# EasyEDA Pro project TeenyV4.eprj, schematic Schematic1

## Sheets
1 Teensy: Board Name: Board1; Create Date: 2025-07-09; Page Name: Teensy; Project Name: TeenyV4; Schematic Name: Schematic1; Update Date: 2025-07-09; Company: Wimble Robotics; Drawed: Michael Wimble; Page Size: A4; Part Number: JLCPCB-002; Reviewed: Michael Wimble; Version: V1.0
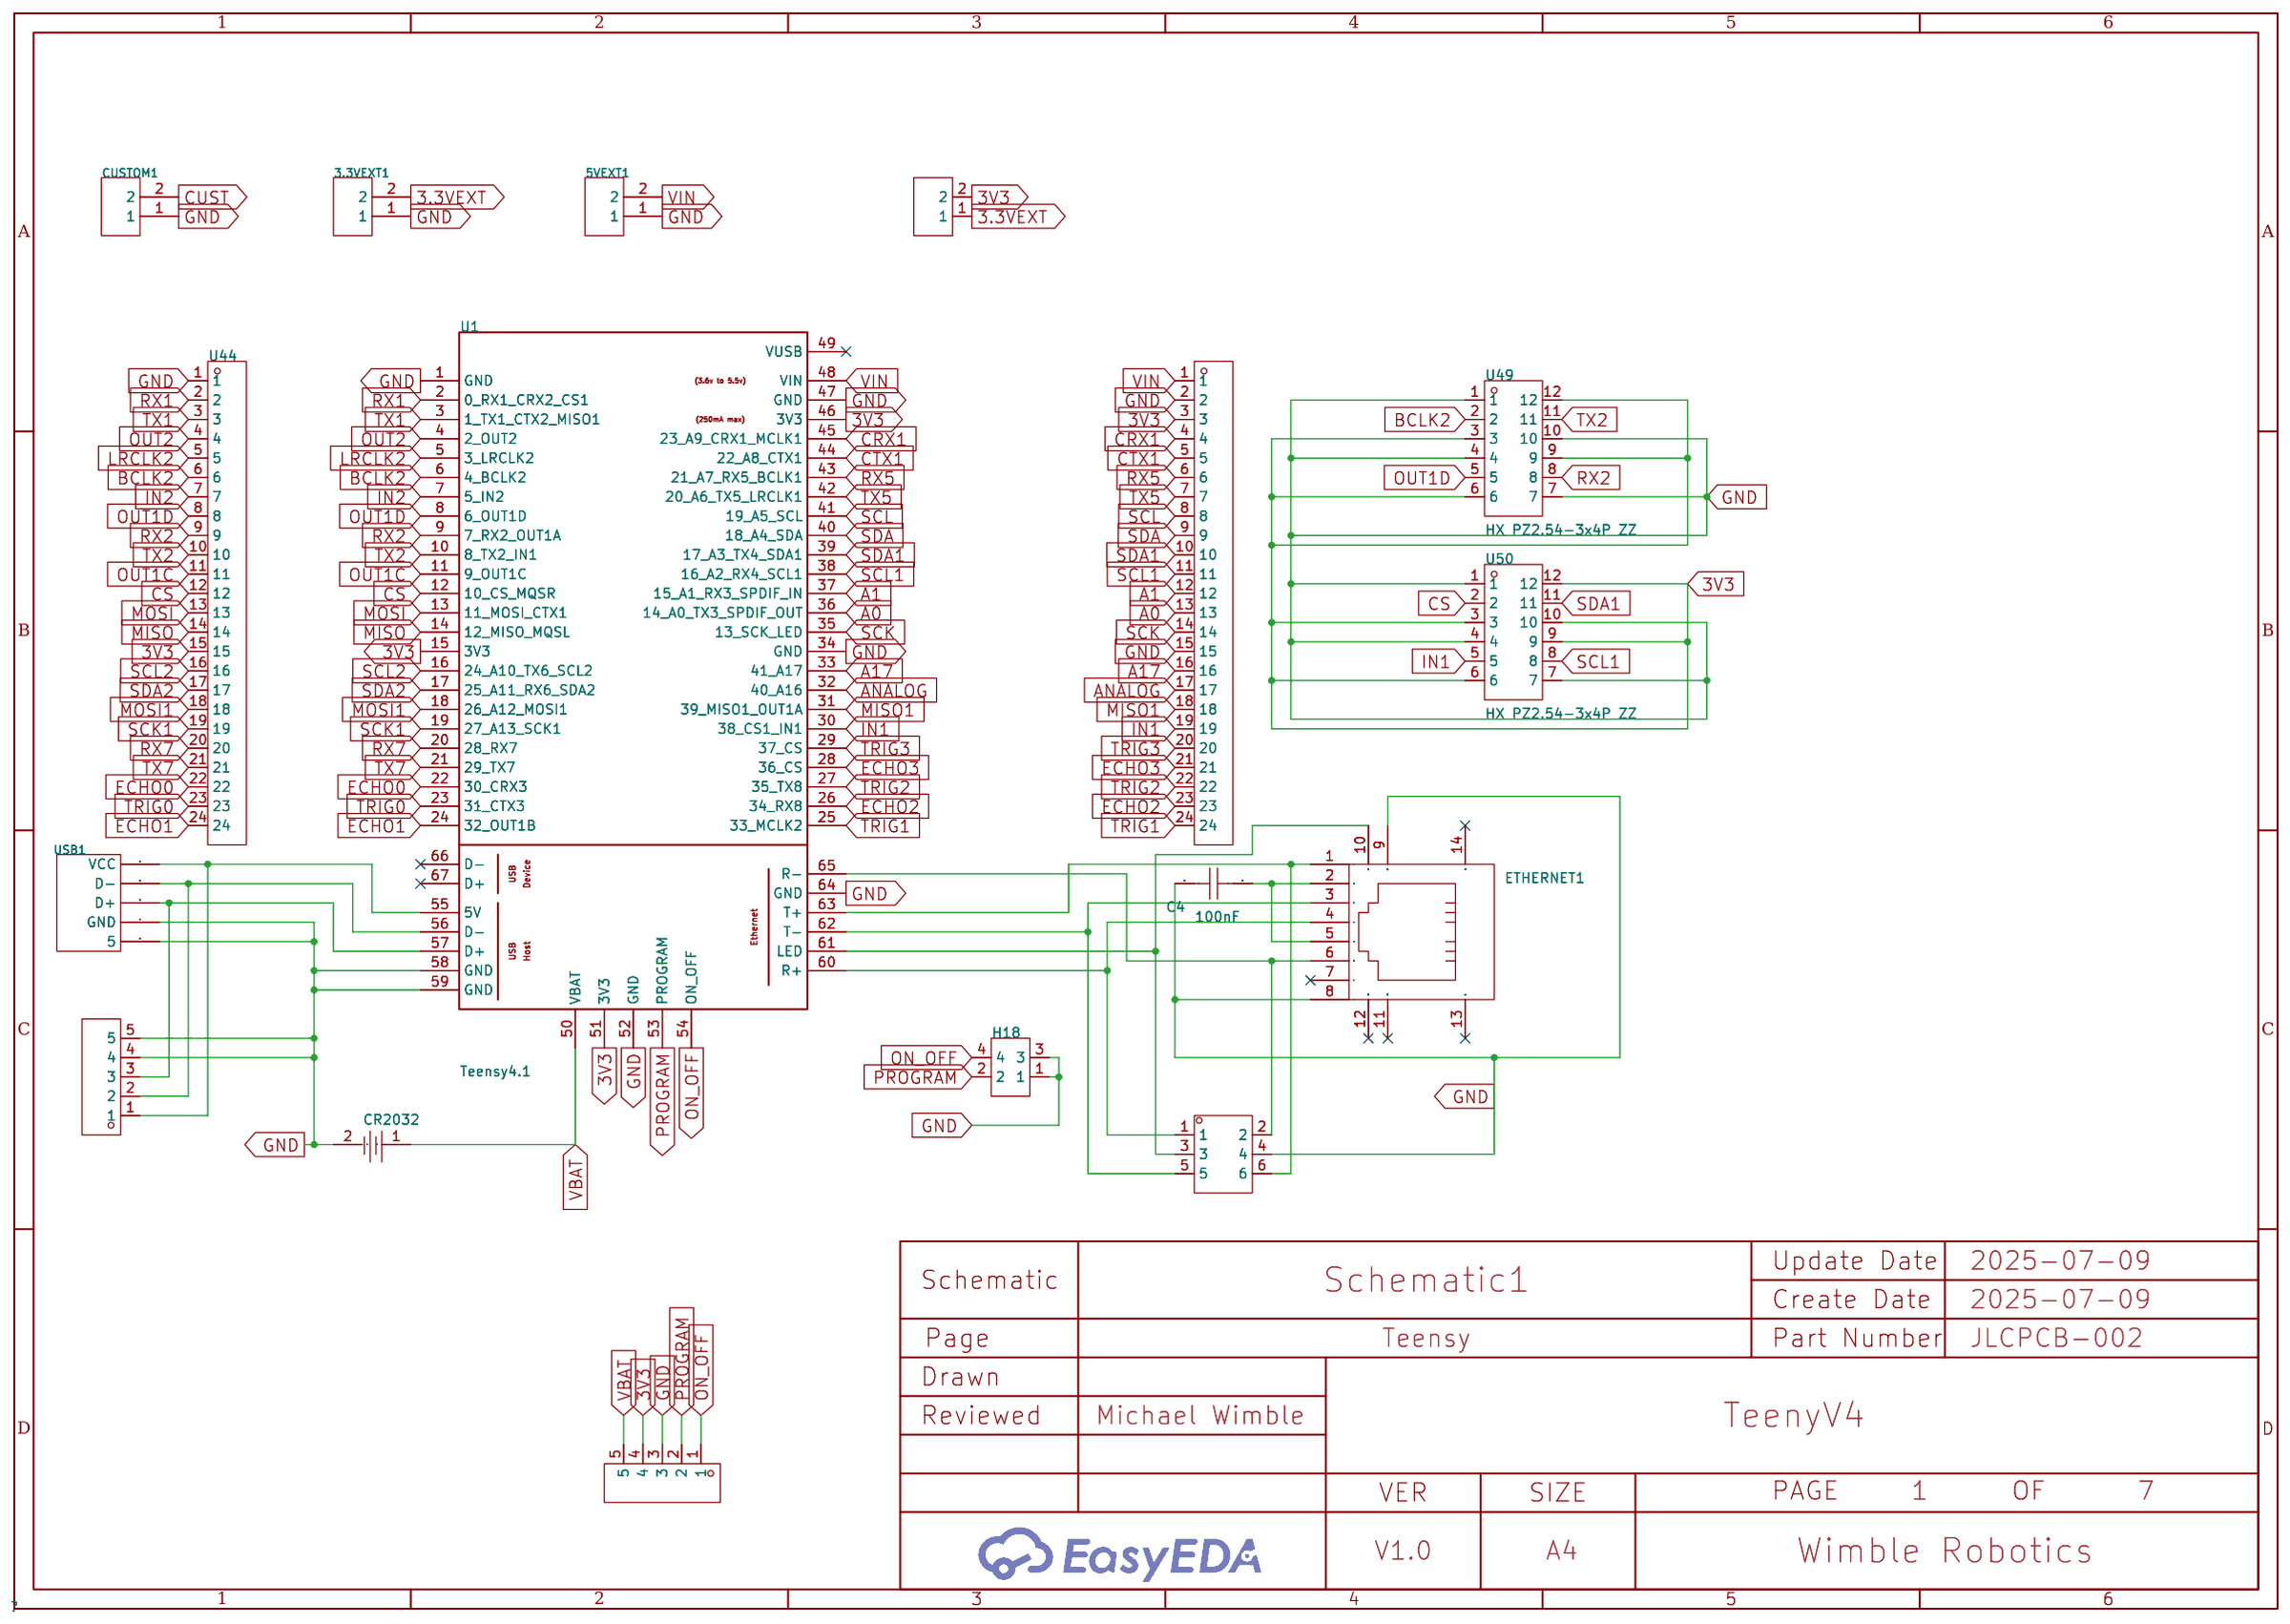
[diagram p0: Teensy]
2 PWM Block: Page Name: PWM Block
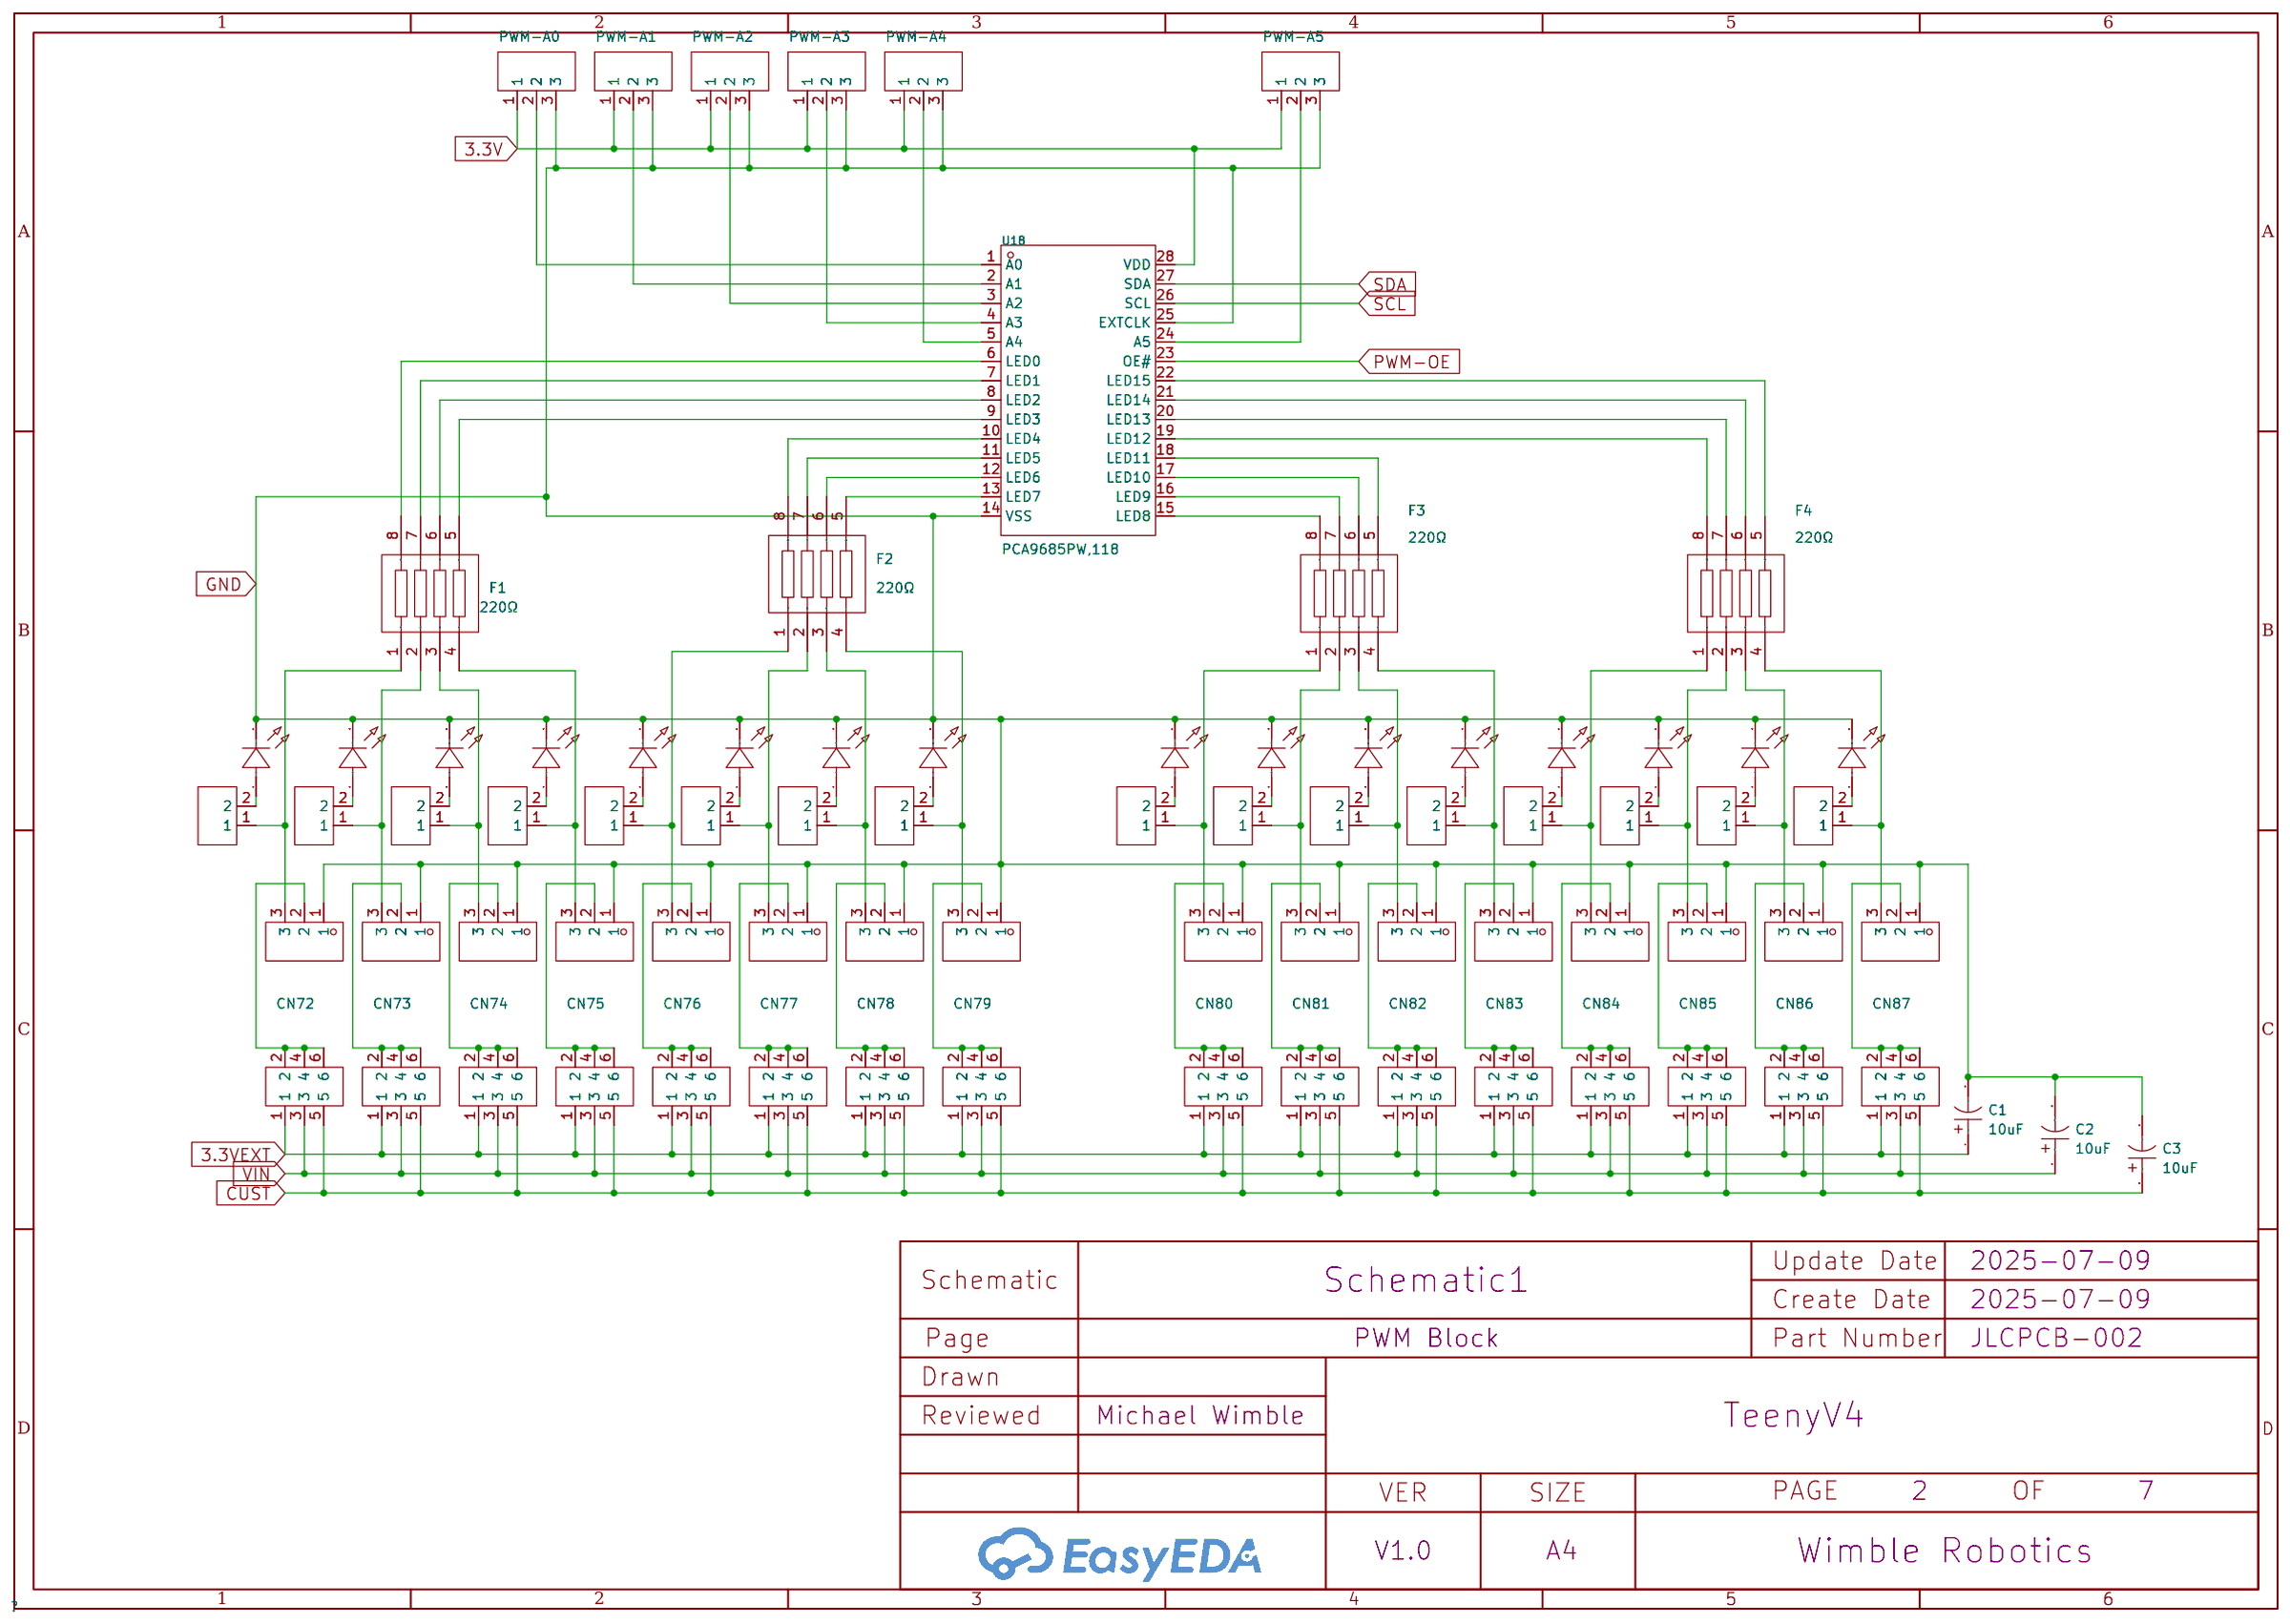
[diagram p1: PWM Block]
3 I2C: Create Date: 2025-07-10; Page Name: I2C
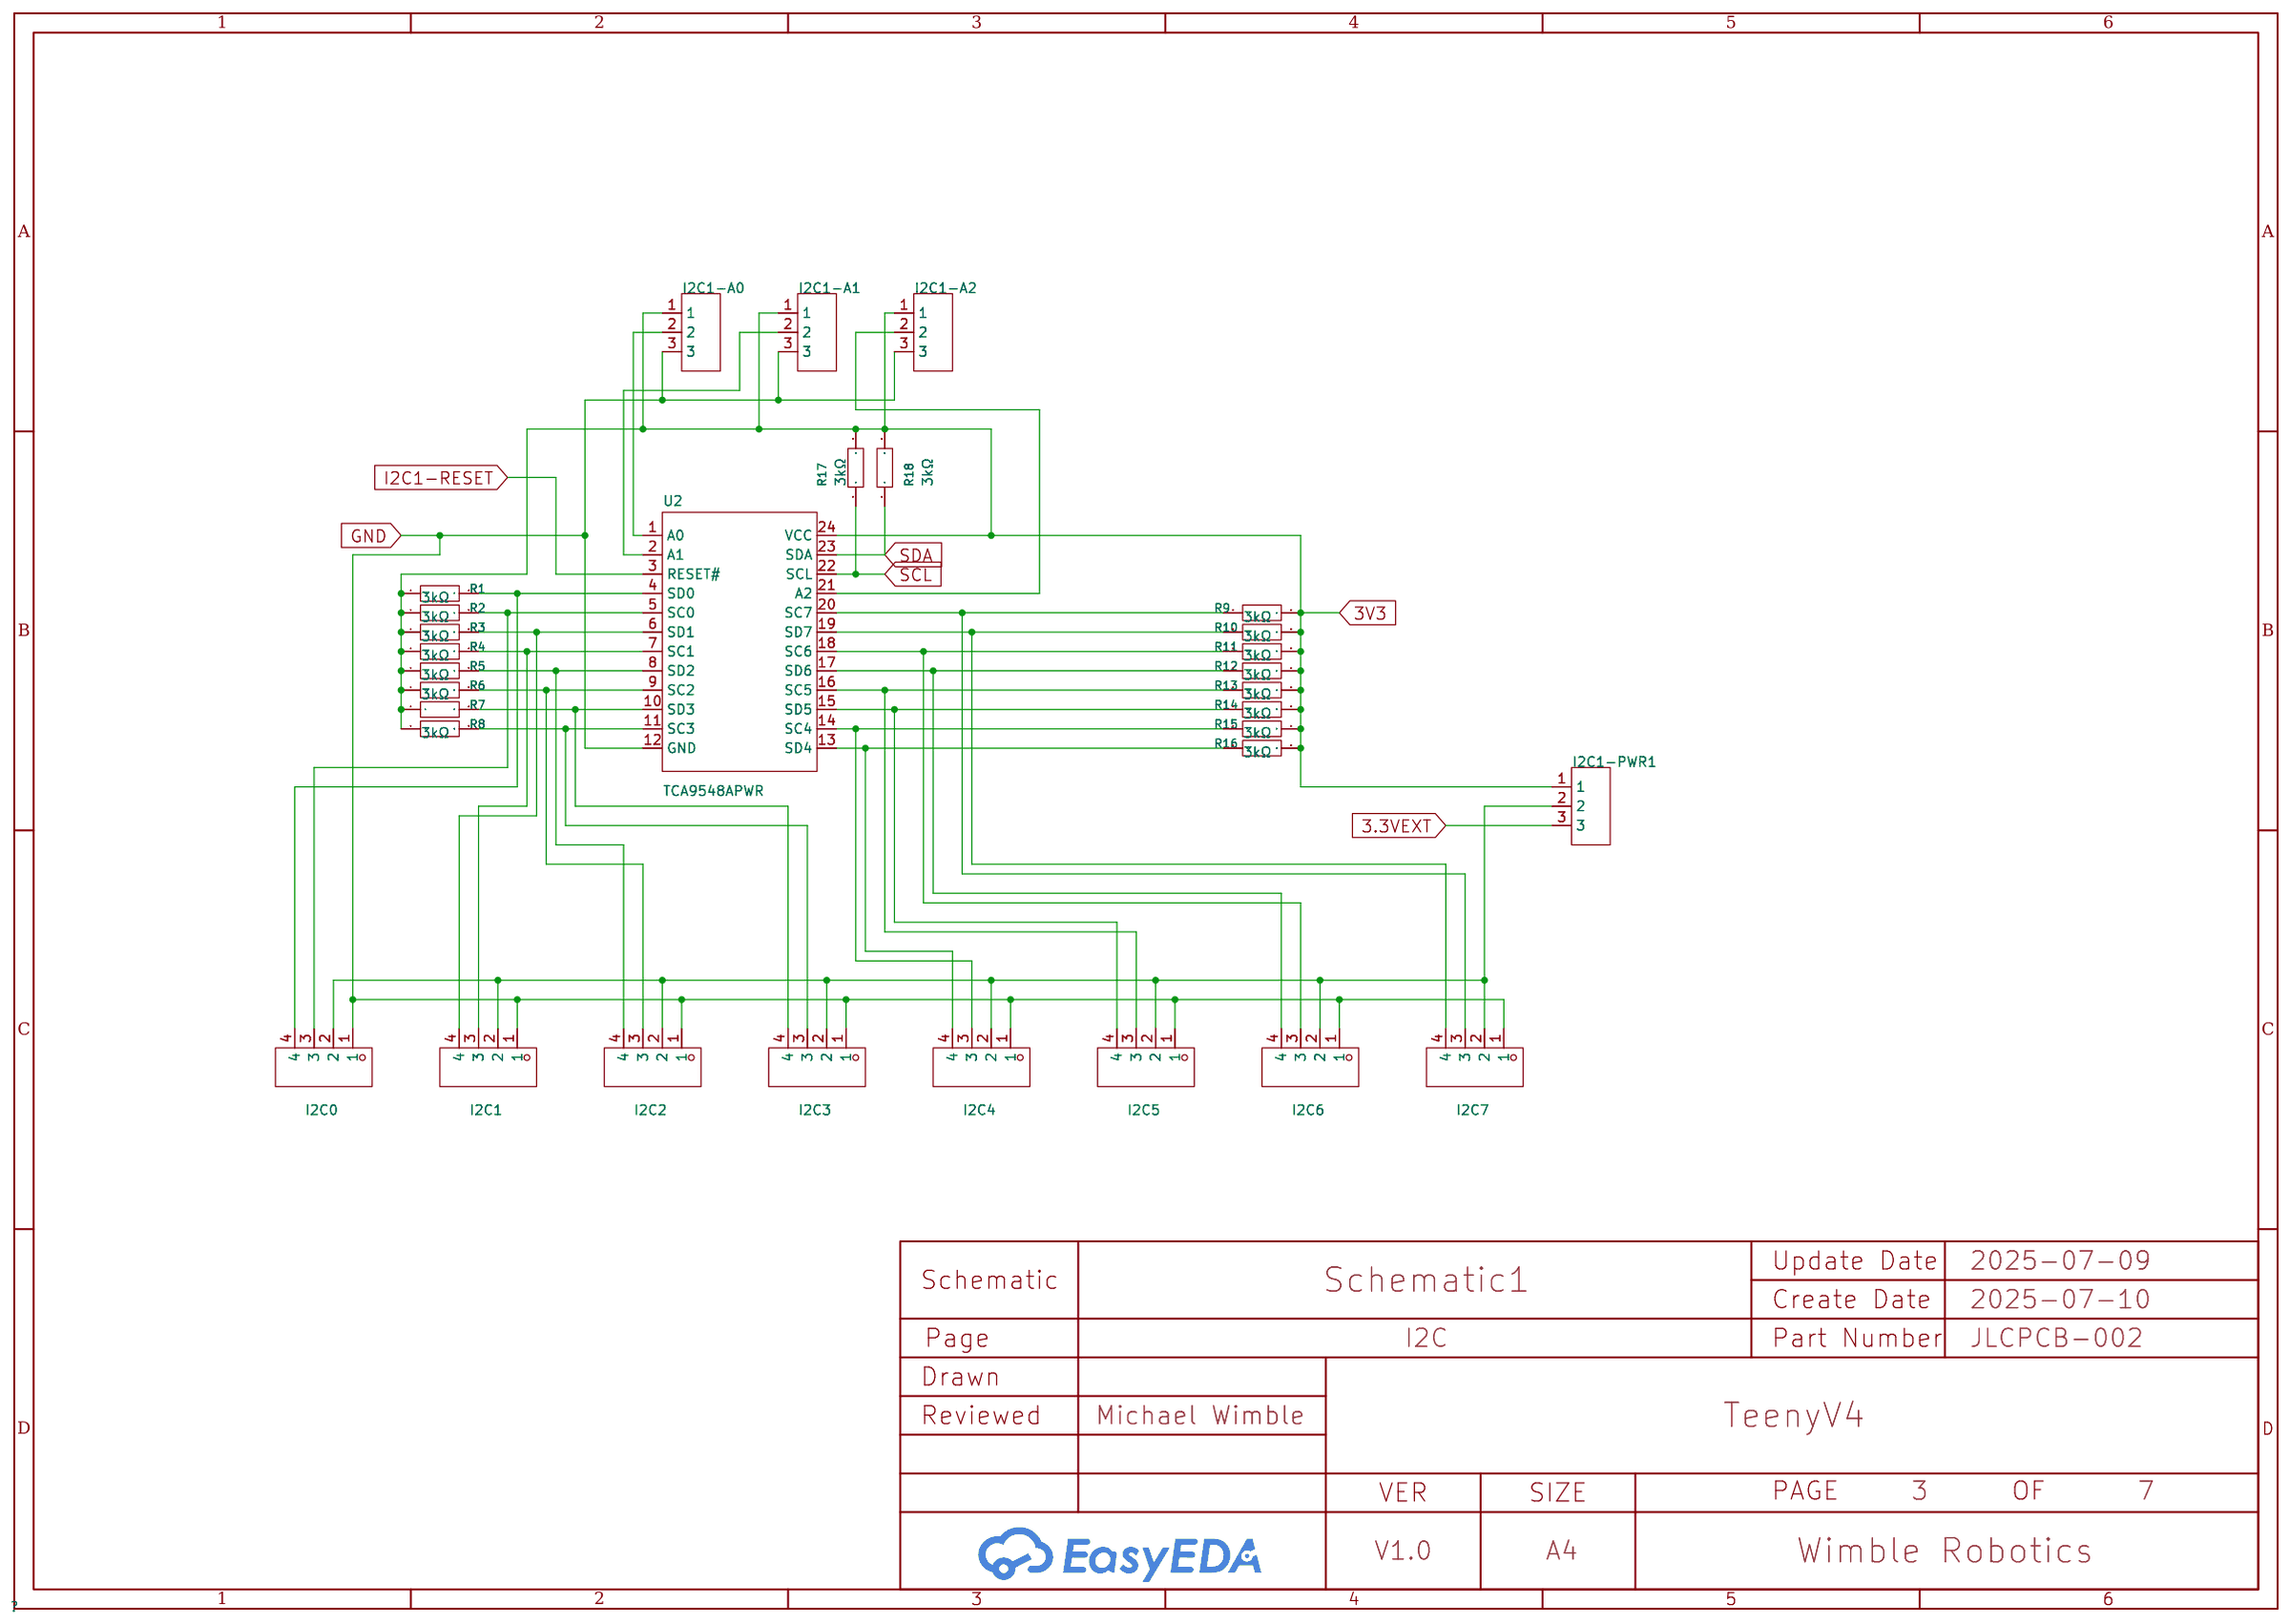
[diagram p2: I2C]
4 GPIO: Create Date: 2025-07-10; Page Name: P4
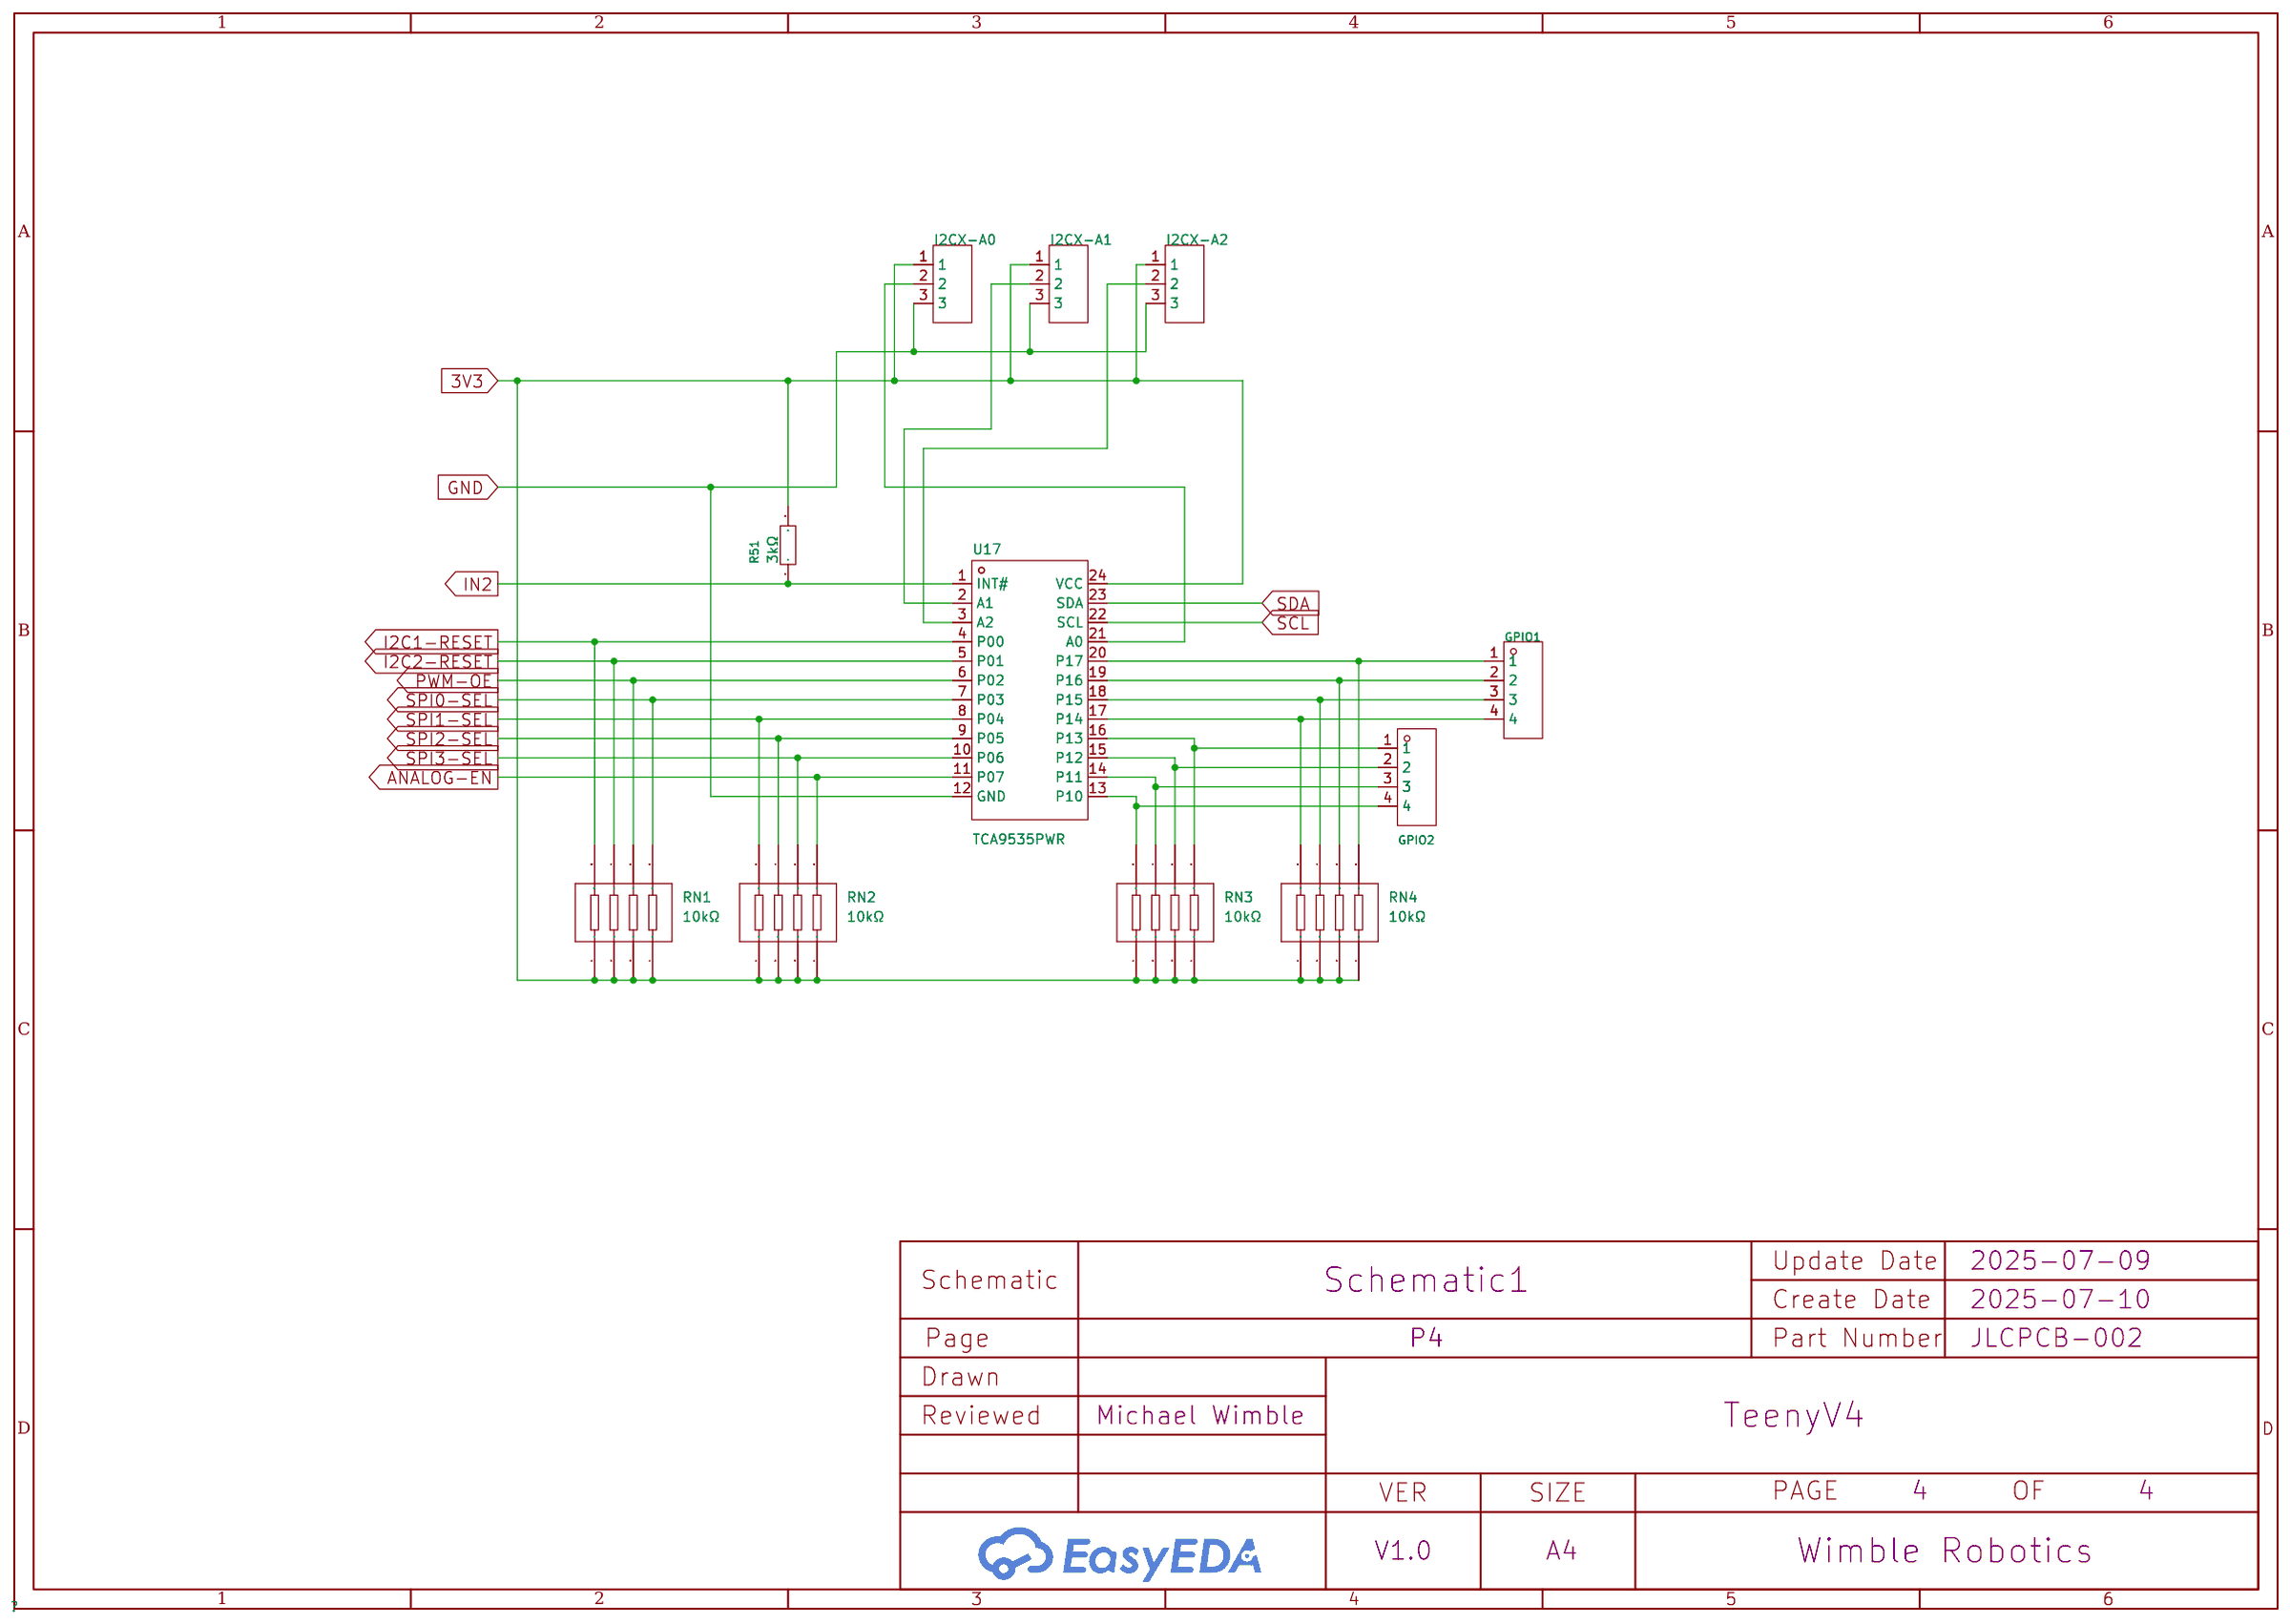
[diagram p3: GPIO]
5 Misc: Create Date: 2025-07-10; Page Name: Misc
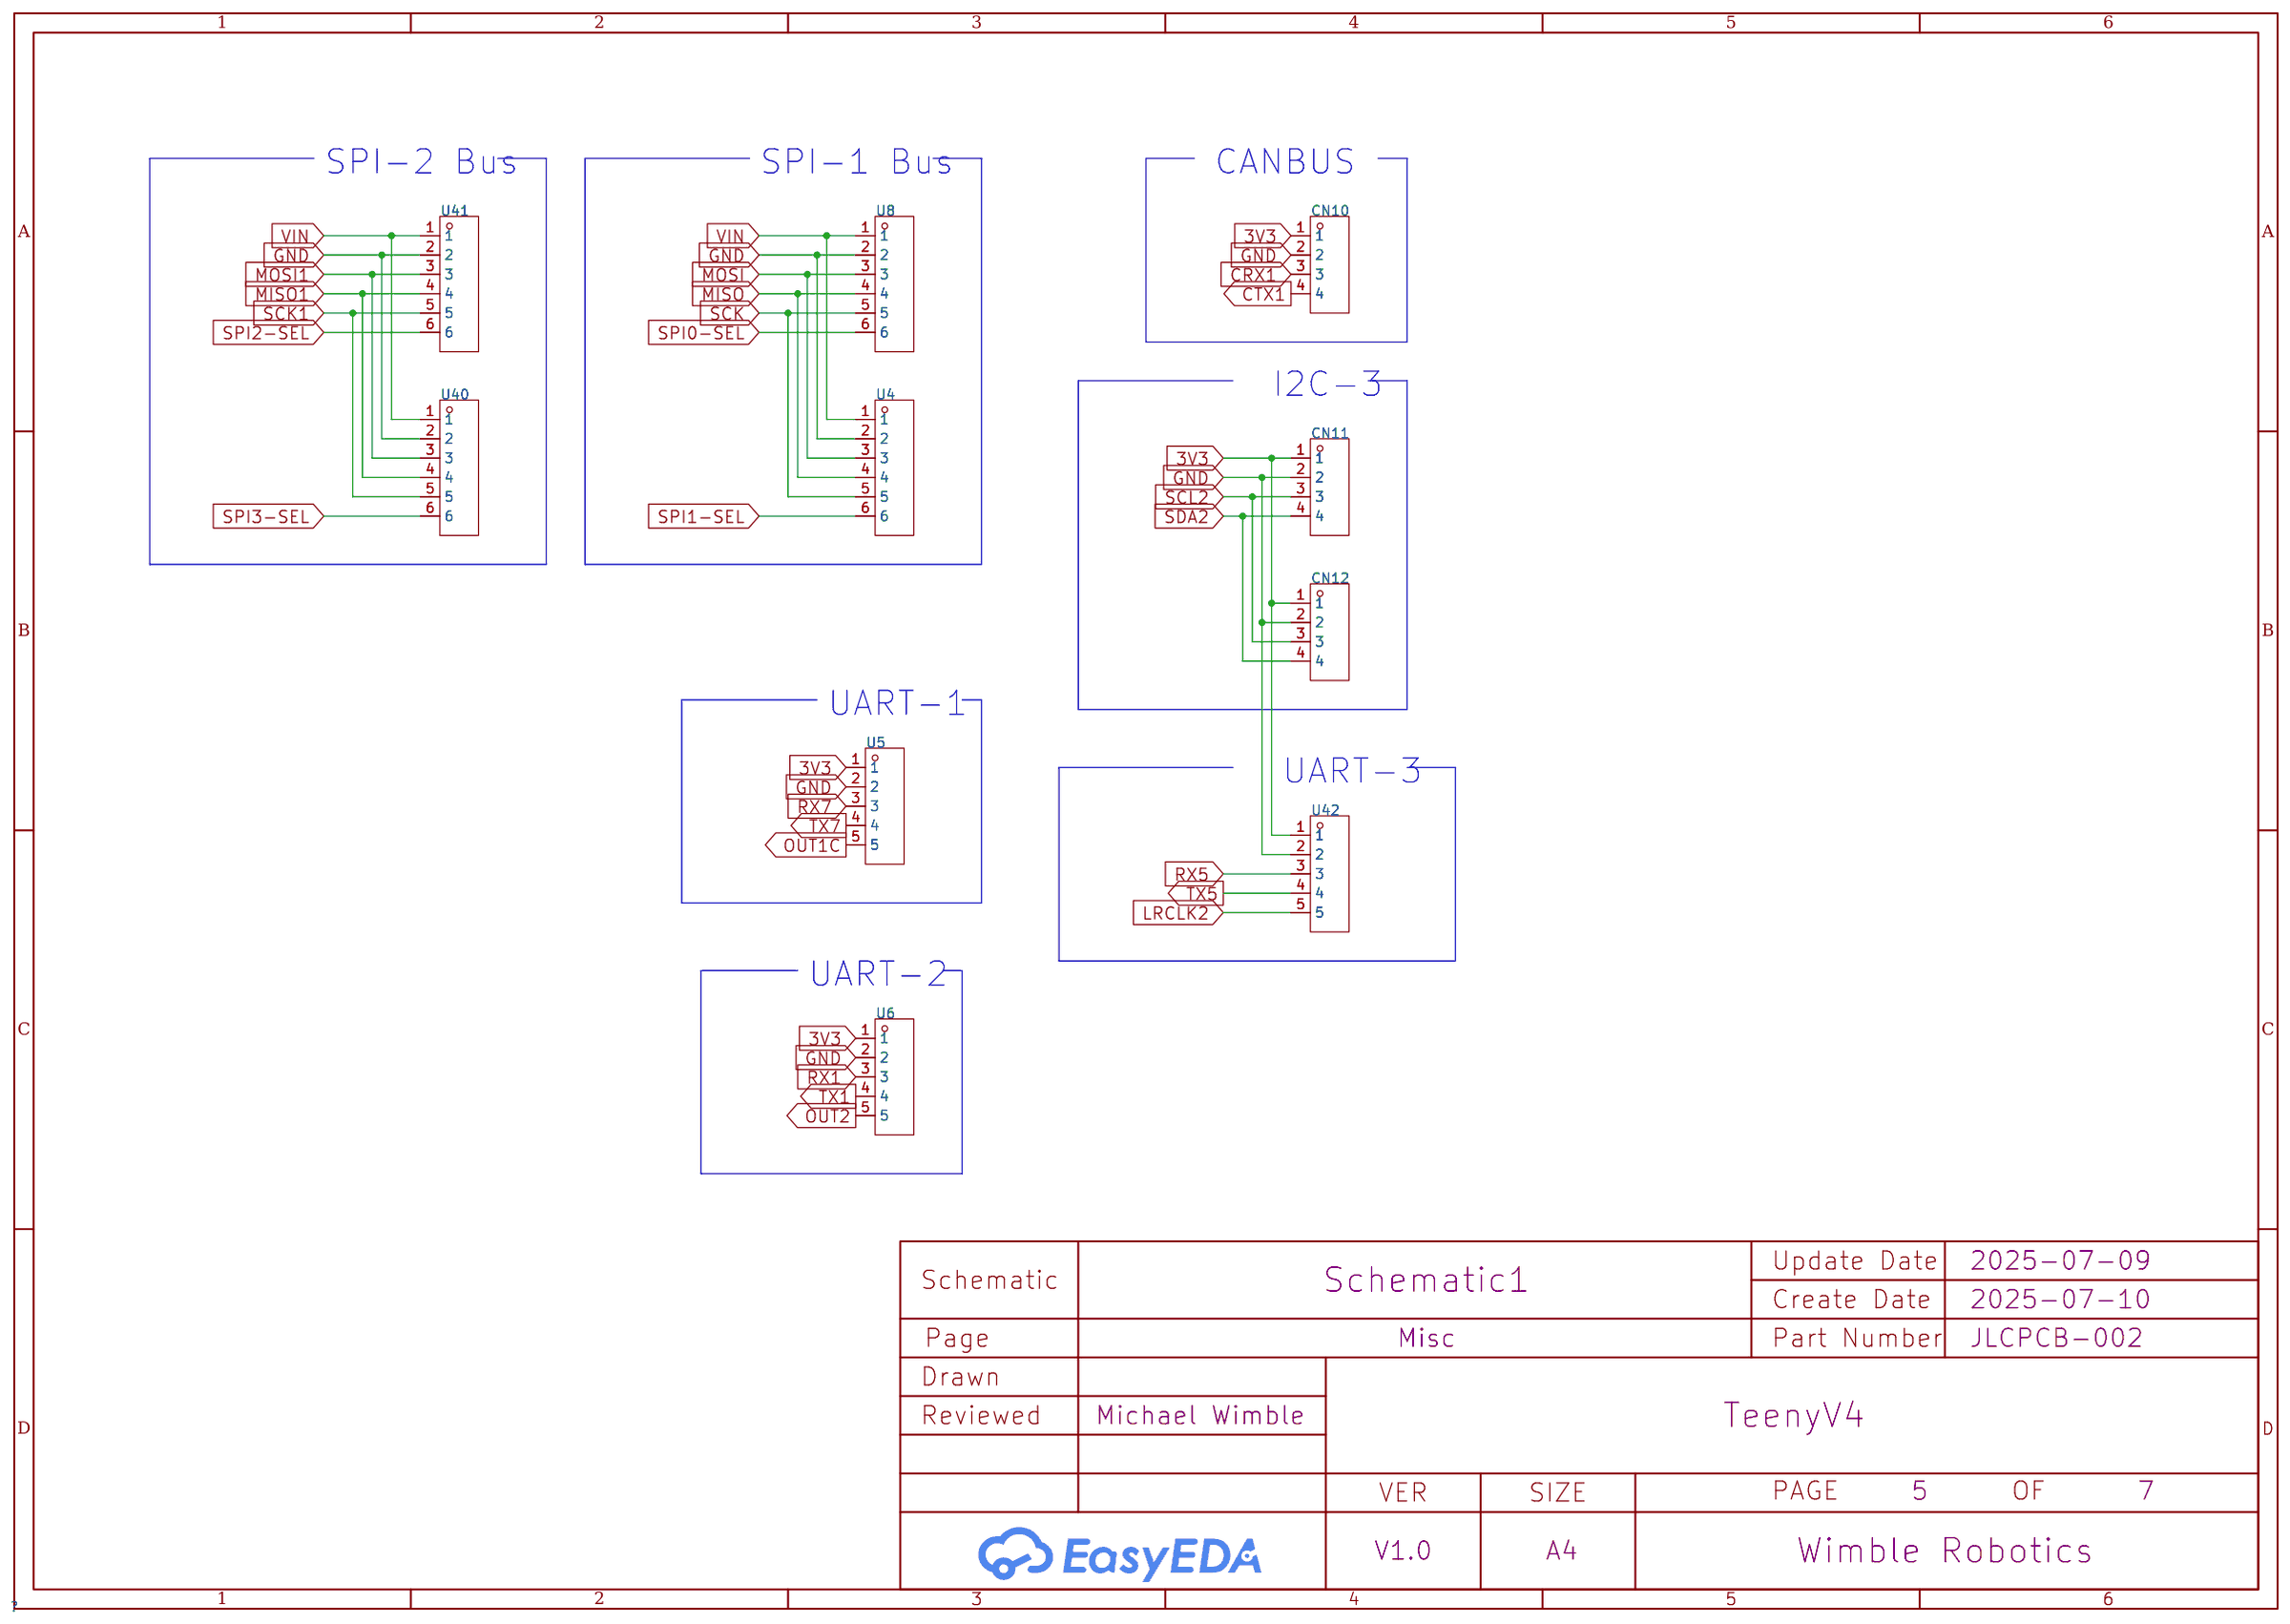
[diagram p4: Misc]
6 Analog: Create Date: 2025-07-10; Page Name: Analog
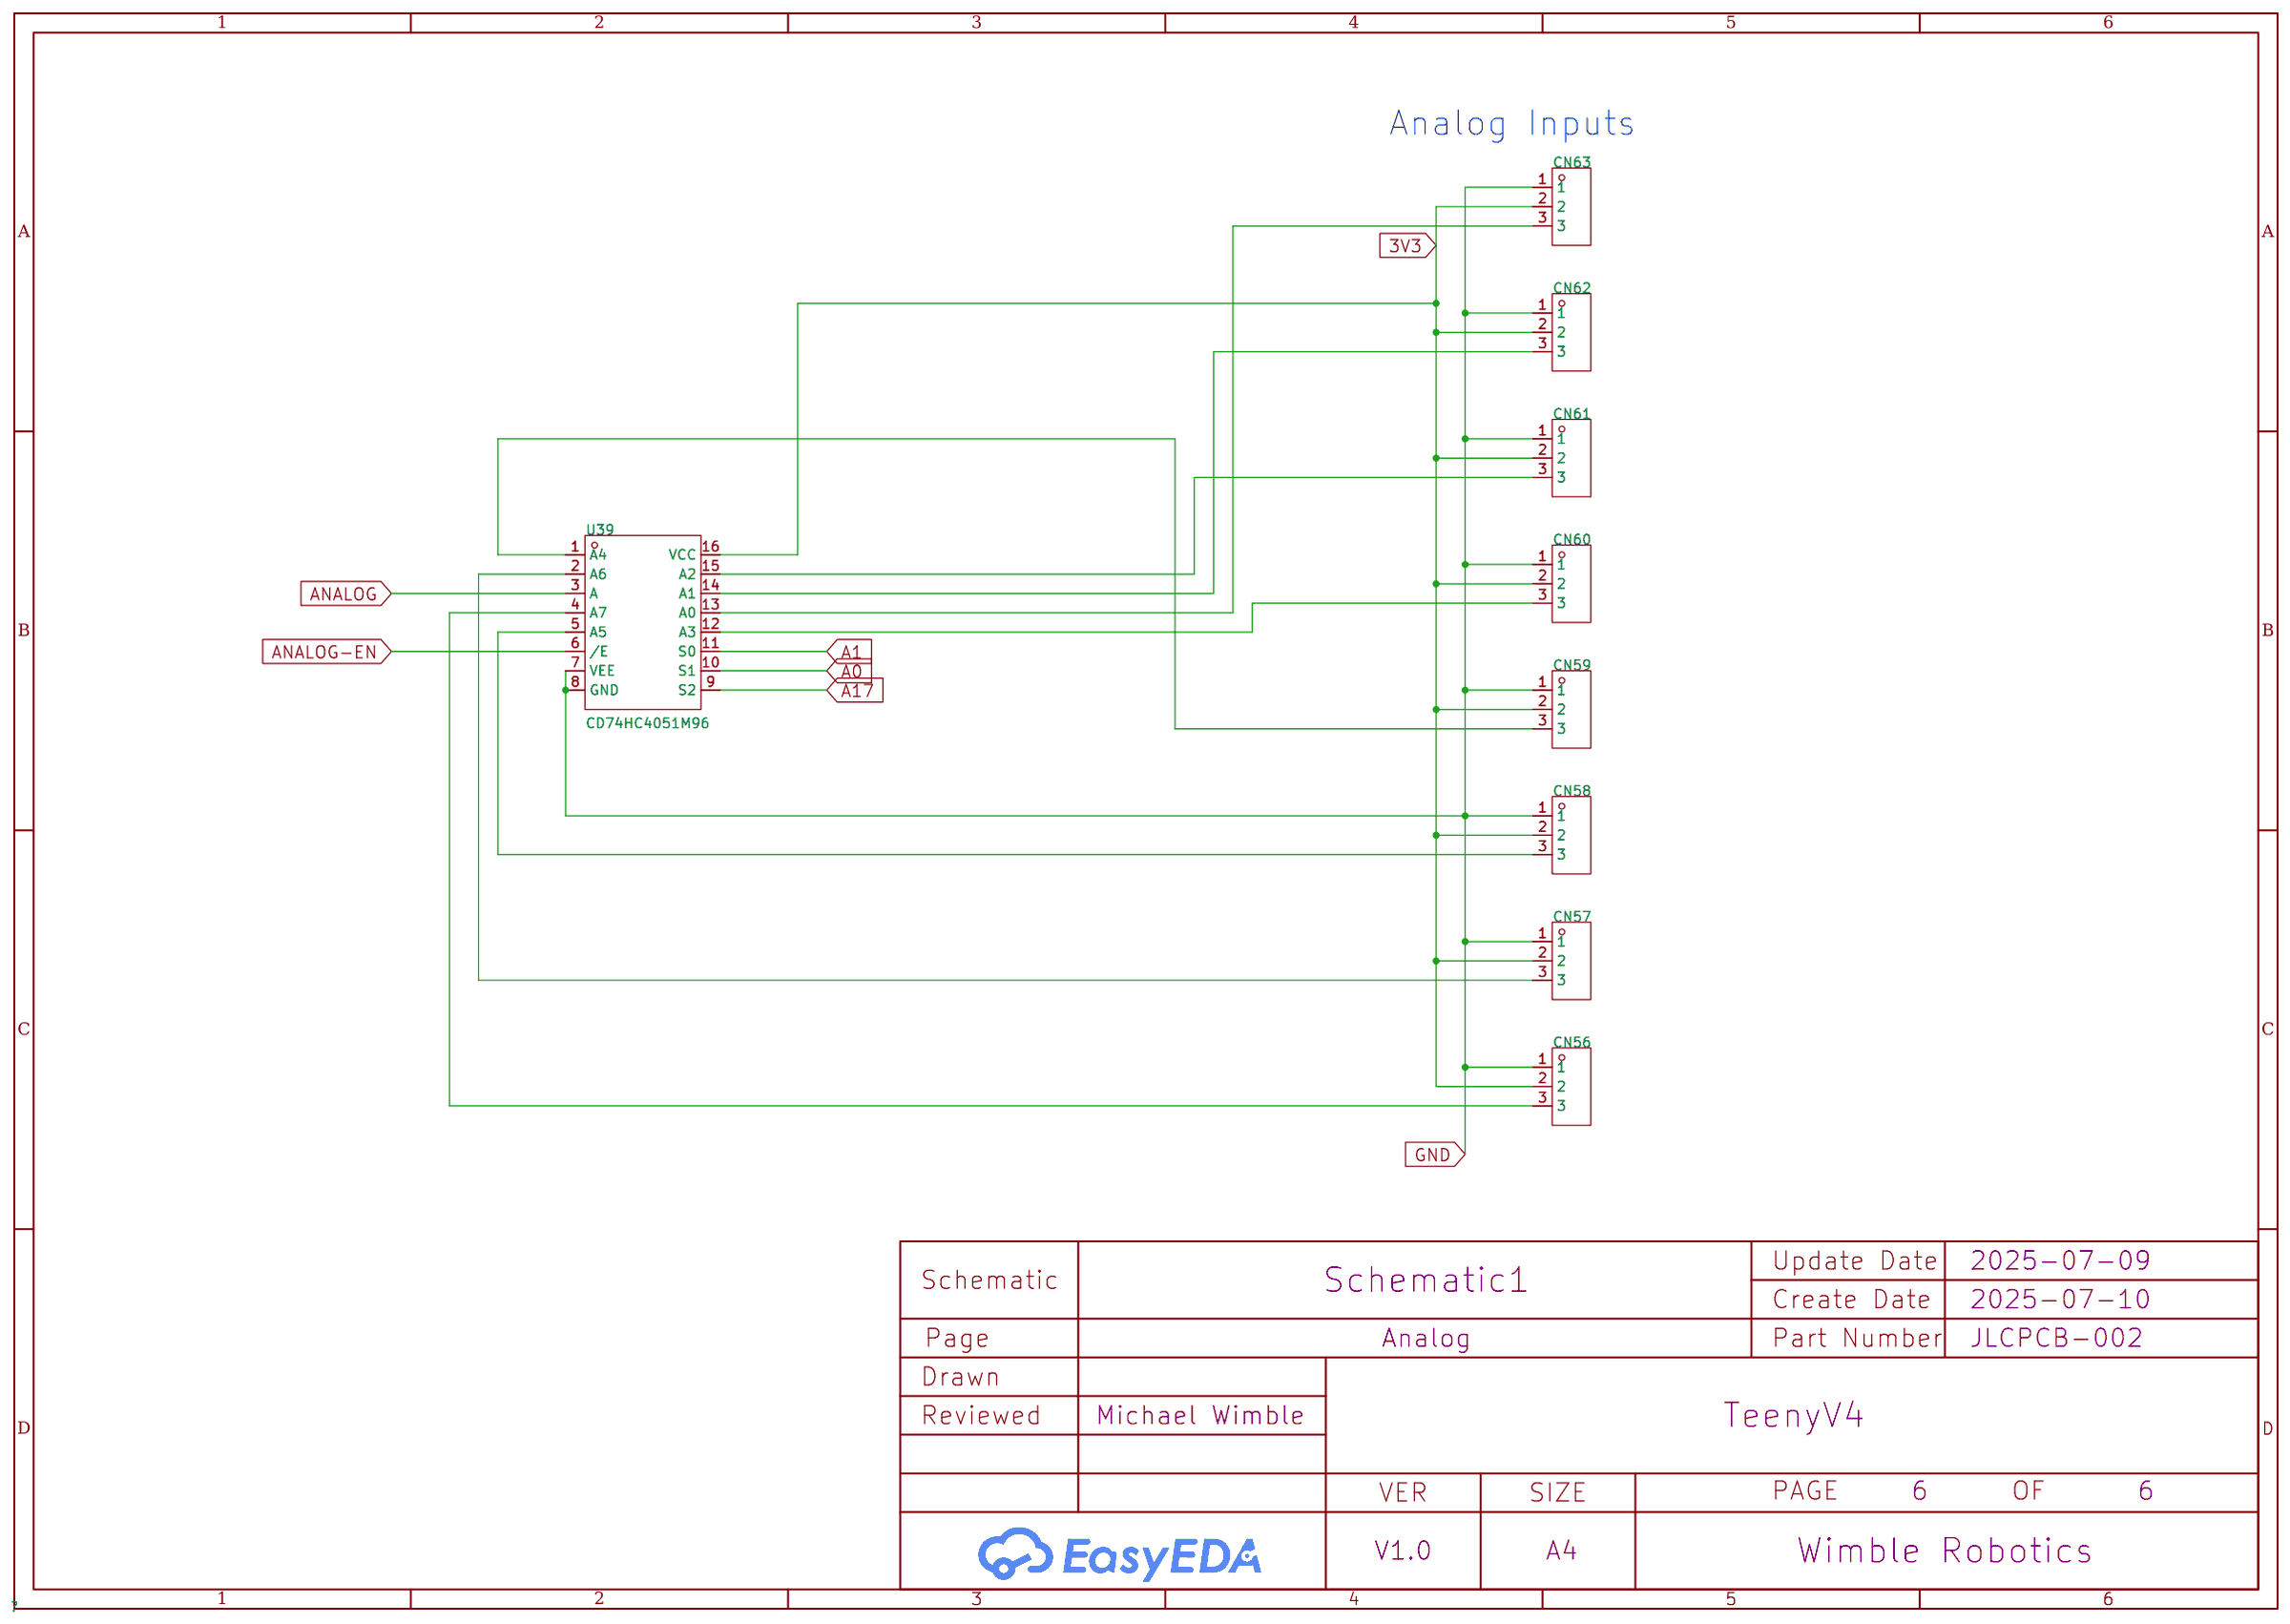
[diagram p5: Analog]
7 Sonar: Create Date: 2025-07-10; Page Name: Sonar
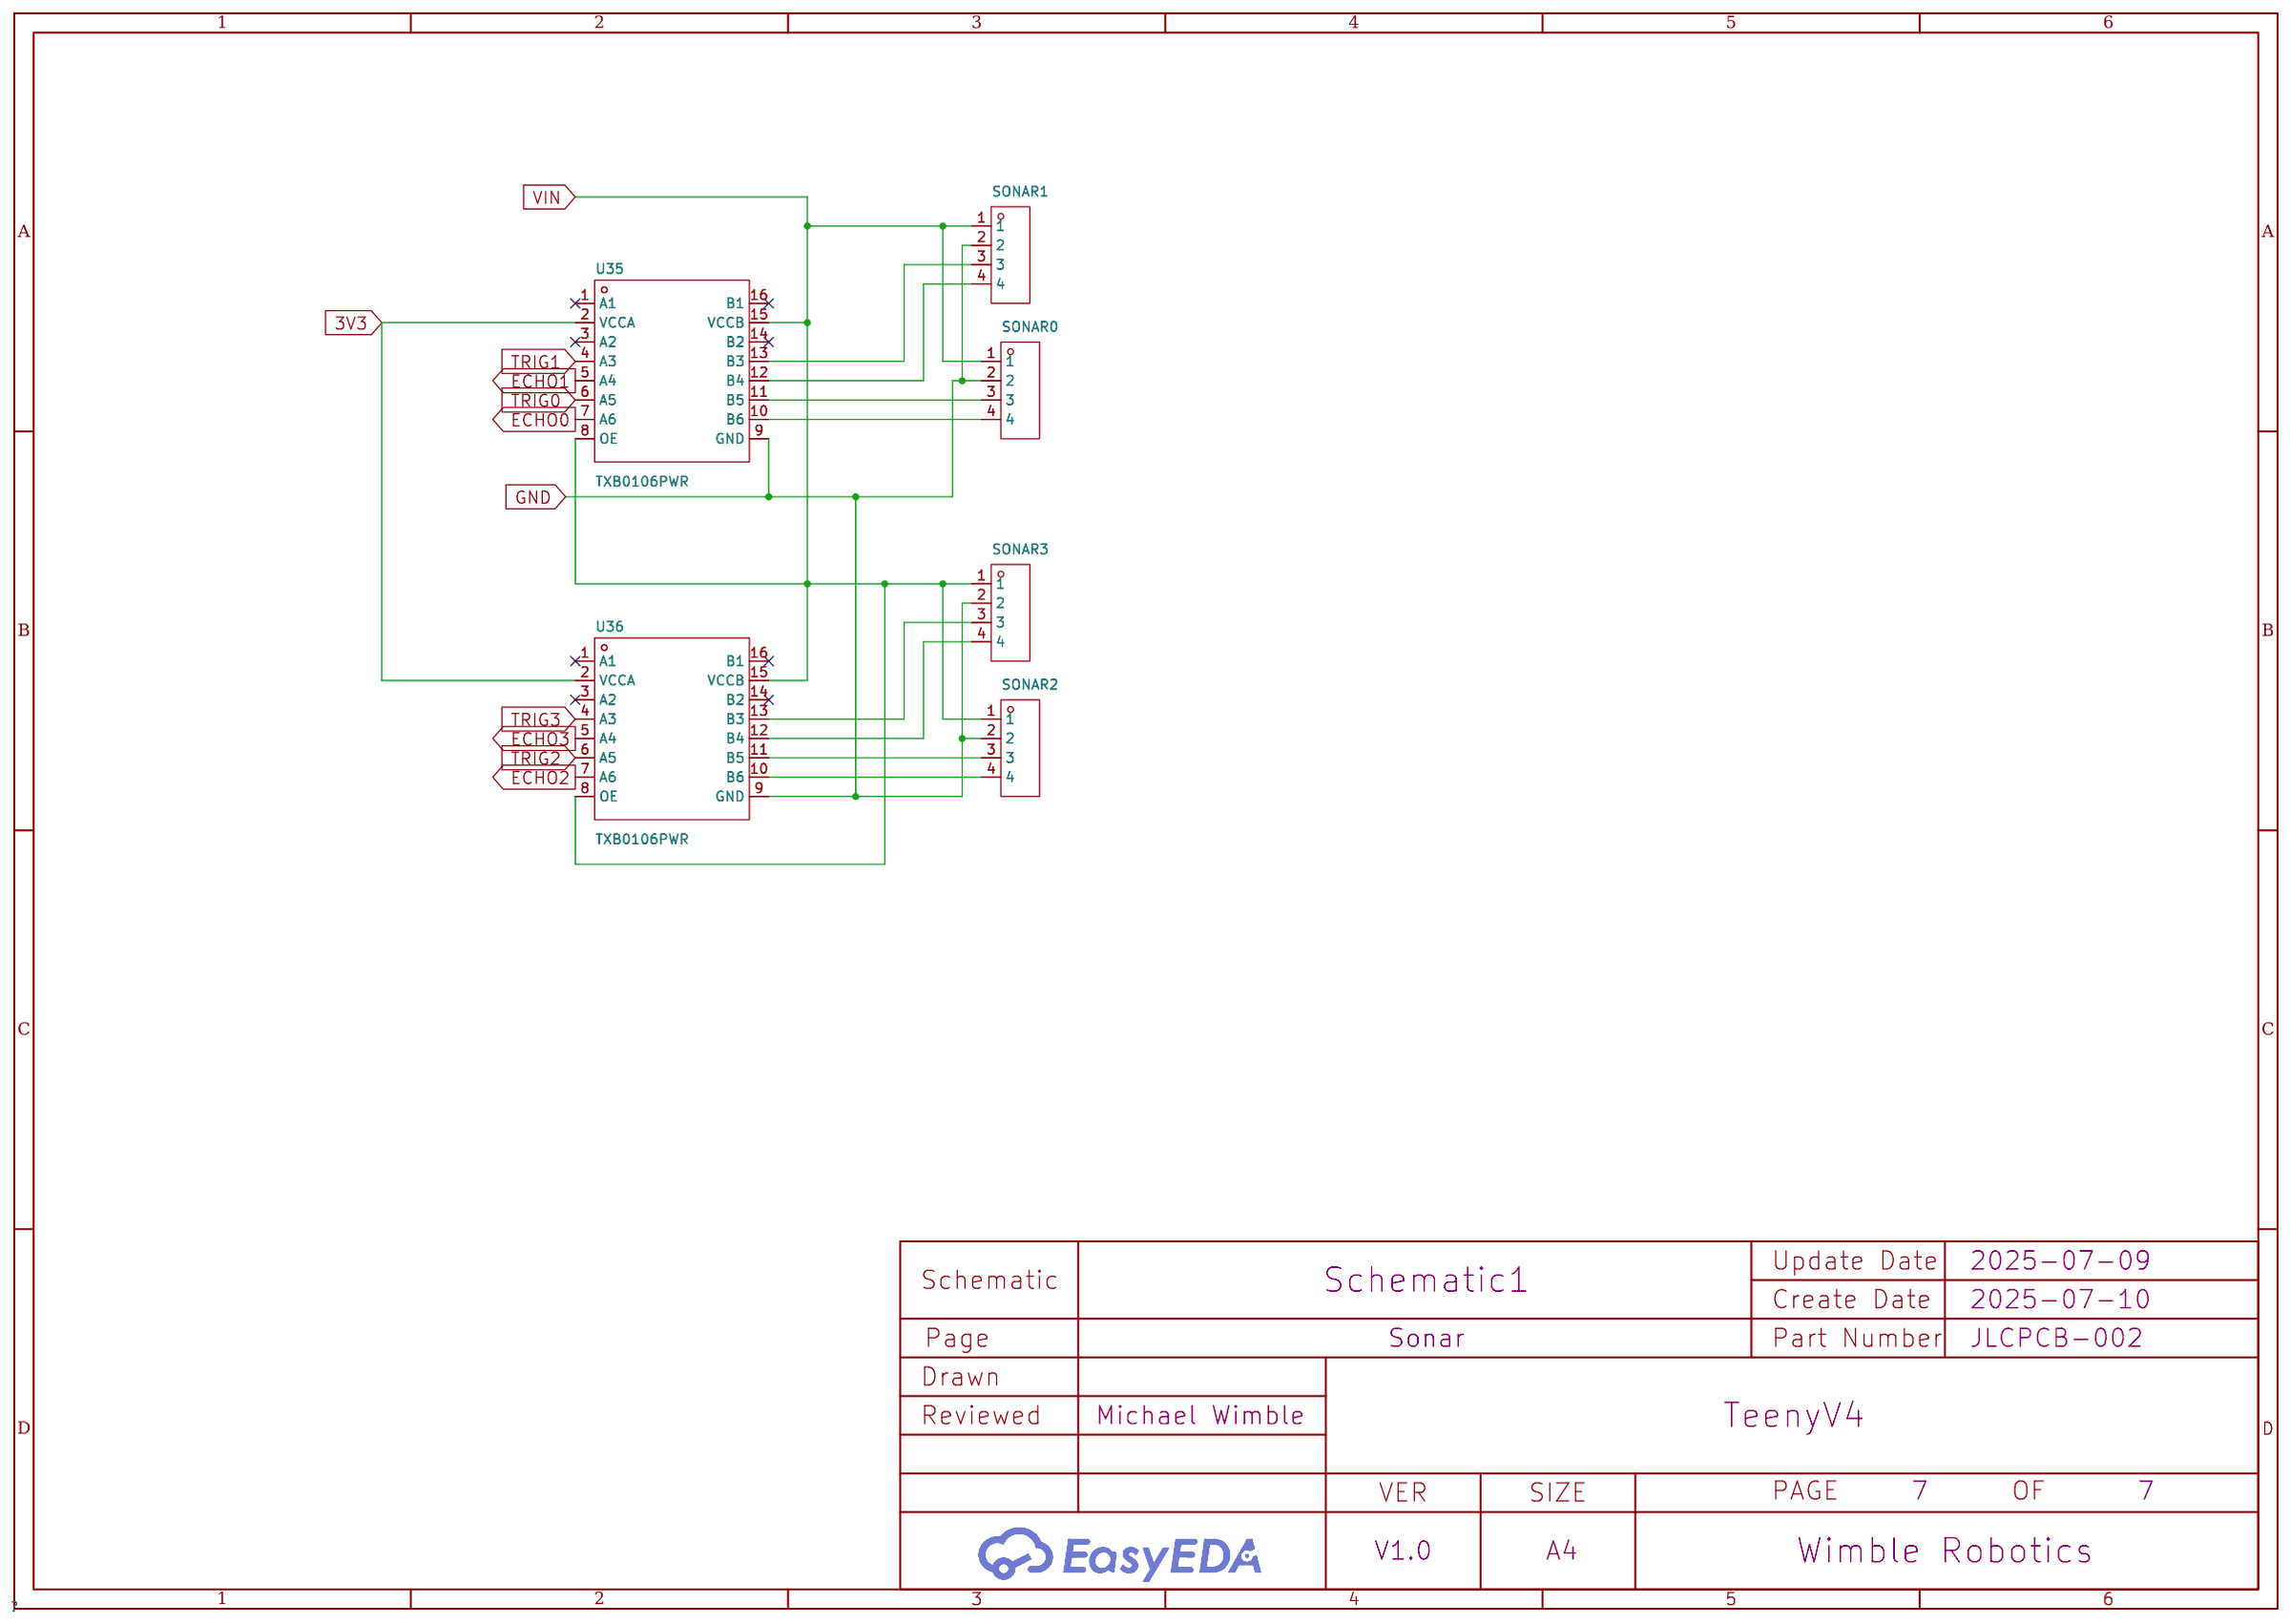
[diagram p6: Sonar]

## Parts
sheet Analog
CN56  ZX-XH2.54-3PZZ  [CONN-TH_3P-P2.54_2501S-3P]
CN57  ZX-XH2.54-3PZZ  [CONN-TH_3P-P2.54_2501S-3P]
CN58  ZX-XH2.54-3PZZ  [CONN-TH_3P-P2.54_2501S-3P]
CN59  ZX-XH2.54-3PZZ  [CONN-TH_3P-P2.54_2501S-3P]
CN60  ZX-XH2.54-3PZZ  [CONN-TH_3P-P2.54_2501S-3P]
CN61  ZX-XH2.54-3PZZ  [CONN-TH_3P-P2.54_2501S-3P]
CN62  ZX-XH2.54-3PZZ  [CONN-TH_3P-P2.54_2501S-3P]
CN63  ZX-XH2.54-3PZZ  [CONN-TH_3P-P2.54_2501S-3P]
U39  CD74HC4051M96  [SOIC-16_L9.9-W3.9-P1.27-LS6.0-BL]
sheet GPIO
GPIO1  PZ254V-11-04P  [HDR-TH_4P-P2.54-V-M]
GPIO2  PZ254V-11-04P  [HDR-TH_4P-P2.54-V-M]
I2CX-A0  PZ254V-11-03P  [HDR-TH_3P-P2.54-V-M]
I2CX-A1  PZ254V-11-03P  [HDR-TH_3P-P2.54-V-M]
I2CX-A2  PZ254V-11-03P  [HDR-TH_3P-P2.54-V-M]
R51  3kΩ  [R0603]
RN1  10kΩ  [RES-ARRAY-SMD_0603-8P-L3.2-W1.6-BL]
RN2  10kΩ  [RES-ARRAY-SMD_0603-8P-L3.2-W1.6-BL]
RN3  10kΩ  [RES-ARRAY-SMD_0603-8P-L3.2-W1.6-BL]
RN4  10kΩ  [RES-ARRAY-SMD_0603-8P-L3.2-W1.6-BL]
U17  TCA9535PWR  [TSSOP-24_L7.8-W4.4-P0.65-LS6.4-BL]
sheet I2C
I2C0  ZX-XH2.54-4PZZ  [CONN-TH_4P-P2.50_4PIN]
I2C1  ZX-XH2.54-4PZZ  [CONN-TH_4P-P2.50_4PIN]
I2C1-A0  PZ254V-11-03P  [HDR-TH_3P-P2.54-V-M]
I2C1-A1  PZ254V-11-03P  [HDR-TH_3P-P2.54-V-M]
I2C1-A2  PZ254V-11-03P  [HDR-TH_3P-P2.54-V-M]
I2C1-PWR1  PZ254V-11-03P  [HDR-TH_3P-P2.54-V-M]
I2C2  ZX-XH2.54-4PZZ  [CONN-TH_4P-P2.50_4PIN]
I2C3  ZX-XH2.54-4PZZ  [CONN-TH_4P-P2.50_4PIN]
I2C4  ZX-XH2.54-4PZZ  [CONN-TH_4P-P2.50_4PIN]
I2C5  ZX-XH2.54-4PZZ  [CONN-TH_4P-P2.50_4PIN]
I2C6  ZX-XH2.54-4PZZ  [CONN-TH_4P-P2.50_4PIN]
I2C7  ZX-XH2.54-4PZZ  [CONN-TH_4P-P2.50_4PIN]
R1  3kΩ  [R0603]
R2  3kΩ  [R0603]
R3  3kΩ  [R0603]
R4  3kΩ  [R0603]
R5  3kΩ  [R0603]
R6  3kΩ  [R0603]
R7  3kΩ  [R0603]
R8  3kΩ  [R0603]
R9  3kΩ  [R0603]
R10  3kΩ  [R0603]
R11  3kΩ  [R0603]
R12  3kΩ  [R0603]
R13  3kΩ  [R0603]
R14  3kΩ  [R0603]
R15  3kΩ  [R0603]
R16  3kΩ  [R0603]
R17  3kΩ  [R0603]
R18  3kΩ  [R0603]
U2  TCA9548APWR  [TSSOP-24_L7.8-W4.4-P0.65-LS6.4-BL]
sheet Misc
CN10  ZX-XH2.54-4PZZ  [CONN-TH_4P-P2.50_4PIN]
CN11  ZX-XH2.54-4PZZ  [CONN-TH_4P-P2.50_4PIN]
CN12  ZX-XH2.54-4PZZ  [CONN-TH_4P-P2.50_4PIN]
U4  ZX-XH2.54-6PZZ  [CONN-TH_6P-P2.50_ZX-XH2.54-6PZZ]
U5  ZX-XH2.54-5PZZ  [CONN-TH_5P-P2.50_ZX-XH2.54-5PZZ]
U6  ZX-XH2.54-5PZZ  [CONN-TH_5P-P2.50_ZX-XH2.54-5PZZ]
U8  ZX-XH2.54-6PZZ  [CONN-TH_6P-P2.50_ZX-XH2.54-6PZZ]
U40  ZX-XH2.54-6PZZ  [CONN-TH_6P-P2.50_ZX-XH2.54-6PZZ]
U41  ZX-XH2.54-6PZZ  [CONN-TH_6P-P2.50_ZX-XH2.54-6PZZ]
U42  ZX-XH2.54-5PZZ  [CONN-TH_5P-P2.50_ZX-XH2.54-5PZZ]
sheet PWM Block
C1  10uF  [CAP-SMD_BD4.0-L4.3-W4.3-LS5.0-FD]
C2  10uF  [CAP-SMD_BD4.0-L4.3-W4.3-LS5.0-FD]
C3  10uF  [CAP-SMD_BD4.0-L4.3-W4.3-LS5.0-FD]
CN72  ZX-XH2.54-3PZZ  [CONN-TH_3P-P2.54_2501S-3P]
CN73  ZX-XH2.54-3PZZ  [CONN-TH_3P-P2.54_2501S-3P]
CN74  ZX-XH2.54-3PZZ  [CONN-TH_3P-P2.54_2501S-3P]
CN75  ZX-XH2.54-3PZZ  [CONN-TH_3P-P2.54_2501S-3P]
CN76  ZX-XH2.54-3PZZ  [CONN-TH_3P-P2.54_2501S-3P]
CN77  ZX-XH2.54-3PZZ  [CONN-TH_3P-P2.54_2501S-3P]
CN78  ZX-XH2.54-3PZZ  [CONN-TH_3P-P2.54_2501S-3P]
CN79  ZX-XH2.54-3PZZ  [CONN-TH_3P-P2.54_2501S-3P]
CN80  ZX-XH2.54-3PZZ  [CONN-TH_3P-P2.54_2501S-3P]
CN81  ZX-XH2.54-3PZZ  [CONN-TH_3P-P2.54_2501S-3P]
CN82  ZX-XH2.54-3PZZ  [CONN-TH_3P-P2.54_2501S-3P]
CN83  ZX-XH2.54-3PZZ  [CONN-TH_3P-P2.54_2501S-3P]
CN84  ZX-XH2.54-3PZZ  [CONN-TH_3P-P2.54_2501S-3P]
CN85  ZX-XH2.54-3PZZ  [CONN-TH_3P-P2.54_2501S-3P]
CN86  ZX-XH2.54-3PZZ  [CONN-TH_3P-P2.54_2501S-3P]
CN87  ZX-XH2.54-3PZZ  [CONN-TH_3P-P2.54_2501S-3P]
F1  220Ω  [RES-ARRAY-SMD_0603-8P-L3.2-W1.6-TL]
F2  220Ω  [RES-ARRAY-SMD_0603-8P-L3.2-W1.6-TL]
F3  220Ω  [RES-ARRAY-SMD_0603-8P-L3.2-W1.6-TL]
F4  220Ω  [RES-ARRAY-SMD_0603-8P-L3.2-W1.6-TL]
H2  PH-00013  [HDR-TH_2P-P2.54-V-M-R2-C1-S2.54]
H3  PH-00013  [HDR-TH_2P-P2.54-V-M-R2-C1-S2.54]
H4  PH-00013  [HDR-TH_2P-P2.54-V-M-R2-C1-S2.54]
H5  PH-00013  [HDR-TH_2P-P2.54-V-M-R2-C1-S2.54]
H6  PH-00013  [HDR-TH_2P-P2.54-V-M-R2-C1-S2.54]
H7  PH-00013  [HDR-TH_2P-P2.54-V-M-R2-C1-S2.54]
H8  PH-00013  [HDR-TH_2P-P2.54-V-M-R2-C1-S2.54]
H9  PH-00013  [HDR-TH_2P-P2.54-V-M-R2-C1-S2.54]
H10  PH-00013  [HDR-TH_2P-P2.54-V-M-R2-C1-S2.54]
H11  PH-00013  [HDR-TH_2P-P2.54-V-M-R2-C1-S2.54]
H12  PH-00013  [HDR-TH_2P-P2.54-V-M-R2-C1-S2.54]
H13  PH-00013  [HDR-TH_2P-P2.54-V-M-R2-C1-S2.54]
H14  PH-00013  [HDR-TH_2P-P2.54-V-M-R2-C1-S2.54]
H15  PH-00013  [HDR-TH_2P-P2.54-V-M-R2-C1-S2.54]
H16  PH-00013  [HDR-TH_2P-P2.54-V-M-R2-C1-S2.54]
H17  PH-00013  [HDR-TH_2P-P2.54-V-M-R2-C1-S2.54]
LED1  19-219/GHC-YR2T1B5Y/3T  [LED-SMD_L1.6-W0.8_19-219-GHC-YR2T1B5Y-3T]
LED2  19-219/GHC-YR2T1B5Y/3T  [LED-SMD_L1.6-W0.8_19-219-GHC-YR2T1B5Y-3T]
LED3  19-219/GHC-YR2T1B5Y/3T  [LED-SMD_L1.6-W0.8_19-219-GHC-YR2T1B5Y-3T]
LED4  19-219/GHC-YR2T1B5Y/3T  [LED-SMD_L1.6-W0.8_19-219-GHC-YR2T1B5Y-3T]
LED5  19-219/GHC-YR2T1B5Y/3T  [LED-SMD_L1.6-W0.8_19-219-GHC-YR2T1B5Y-3T]
LED6  19-219/GHC-YR2T1B5Y/3T  [LED-SMD_L1.6-W0.8_19-219-GHC-YR2T1B5Y-3T]
LED7  19-219/GHC-YR2T1B5Y/3T  [LED-SMD_L1.6-W0.8_19-219-GHC-YR2T1B5Y-3T]
LED8  19-219/GHC-YR2T1B5Y/3T  [LED-SMD_L1.6-W0.8_19-219-GHC-YR2T1B5Y-3T]
LED9  19-219/GHC-YR2T1B5Y/3T  [LED-SMD_L1.6-W0.8_19-219-GHC-YR2T1B5Y-3T]
LED10  19-219/GHC-YR2T1B5Y/3T  [LED-SMD_L1.6-W0.8_19-219-GHC-YR2T1B5Y-3T]
LED11  19-219/GHC-YR2T1B5Y/3T  [LED-SMD_L1.6-W0.8_19-219-GHC-YR2T1B5Y-3T]
LED12  19-219/GHC-YR2T1B5Y/3T  [LED-SMD_L1.6-W0.8_19-219-GHC-YR2T1B5Y-3T]
LED13  19-219/GHC-YR2T1B5Y/3T  [LED-SMD_L1.6-W0.8_19-219-GHC-YR2T1B5Y-3T]
LED14  19-219/GHC-YR2T1B5Y/3T  [LED-SMD_L1.6-W0.8_19-219-GHC-YR2T1B5Y-3T]
LED15  19-219/GHC-YR2T1B5Y/3T  [LED-SMD_L1.6-W0.8_19-219-GHC-YR2T1B5Y-3T]
LED16  19-219/GHC-YR2T1B5Y/3T  [LED-SMD_L1.6-W0.8_19-219-GHC-YR2T1B5Y-3T]
PWM-A0  PZ254V-11-03P  [HDR-TH_3P-P2.54-V-M]
PWM-A1  PZ254V-11-03P  [HDR-TH_3P-P2.54-V-M]
PWM-A2  PZ254V-11-03P  [HDR-TH_3P-P2.54-V-M]
PWM-A3  PZ254V-11-03P  [HDR-TH_3P-P2.54-V-M]
PWM-A4  PZ254V-11-03P  [HDR-TH_3P-P2.54-V-M]
PWM-A5  PZ254V-11-03P  [HDR-TH_3P-P2.54-V-M]
U18  PCA9685PW,118  [TSSOP-28_L9.7-W4.4-P0.65-LS6.4-TL]
U19  BX-PZ2.54-2-3PZZ  [HDR-TH_6P-P2.54-V-M-R2-C3-S2.54]
U20  BX-PZ2.54-2-3PZZ  [HDR-TH_6P-P2.54-V-M-R2-C3-S2.54]
U21  BX-PZ2.54-2-3PZZ  [HDR-TH_6P-P2.54-V-M-R2-C3-S2.54]
U22  BX-PZ2.54-2-3PZZ  [HDR-TH_6P-P2.54-V-M-R2-C3-S2.54]
U23  BX-PZ2.54-2-3PZZ  [HDR-TH_6P-P2.54-V-M-R2-C3-S2.54]
U24  BX-PZ2.54-2-3PZZ  [HDR-TH_6P-P2.54-V-M-R2-C3-S2.54]
U25  BX-PZ2.54-2-3PZZ  [HDR-TH_6P-P2.54-V-M-R2-C3-S2.54]
U26  BX-PZ2.54-2-3PZZ  [HDR-TH_6P-P2.54-V-M-R2-C3-S2.54]
U27  BX-PZ2.54-2-3PZZ  [HDR-TH_6P-P2.54-V-M-R2-C3-S2.54]
U28  BX-PZ2.54-2-3PZZ  [HDR-TH_6P-P2.54-V-M-R2-C3-S2.54]
U29  BX-PZ2.54-2-3PZZ  [HDR-TH_6P-P2.54-V-M-R2-C3-S2.54]
U30  BX-PZ2.54-2-3PZZ  [HDR-TH_6P-P2.54-V-M-R2-C3-S2.54]
U31  BX-PZ2.54-2-3PZZ  [HDR-TH_6P-P2.54-V-M-R2-C3-S2.54]
U32  BX-PZ2.54-2-3PZZ  [HDR-TH_6P-P2.54-V-M-R2-C3-S2.54]
U33  BX-PZ2.54-2-3PZZ  [HDR-TH_6P-P2.54-V-M-R2-C3-S2.54]
U34  BX-PZ2.54-2-3PZZ  [HDR-TH_6P-P2.54-V-M-R2-C3-S2.54]
sheet Sonar
SONAR0  ZX-XH2.54-4PZZ  [CONN-TH_4P-P2.50_4PIN]
SONAR1  ZX-XH2.54-4PZZ  [CONN-TH_4P-P2.50_4PIN]
SONAR2  ZX-XH2.54-4PZZ  [CONN-TH_4P-P2.50_4PIN]
SONAR3  ZX-XH2.54-4PZZ  [CONN-TH_4P-P2.50_4PIN]
U35  TXB0106PWR  [TSSOP-16_L5.0-W4.4-P0.65-LS6.4-BL]
U36  TXB0106PWR  [TSSOP-16_L5.0-W4.4-P0.65-LS6.4-BL]
sheet Teensy
3.3VEXT1  WJ127-5.0-2P  [CONN-TH_2P-P5.00_CPC3703CTR]
5VEXT1  WJ127-5.0-2P  [CONN-TH_2P-P5.00_CPC3703CTR]
C4  100nF  [C0805]
CR2032  CR2032-BS-6  [BAT-TH_CR2032-BS-6-1]
CUSTOM1  WJ127-5.0-2P  [CONN-TH_2P-P5.00_CPC3703CTR]
ETHERNET1  J1B1211CCD  [RJ45-TH_J1B1211CCD]
H18  HX PZ2.54-2x2P ZZ  [HDR-TH_HX-PZ2.54-2X2P-ZZ]
H19  PH-00013  [HDR-TH_2P-P2.54-V-M-R2-C1-S2.54]
U1  Teensy4.1  [Teensy41KiCad]
U43  HC-PM254-8.5H-1x24PZ  [HDR-TH_24P-P2.54-V-F]
U44  HC-PM254-8.5H-1x24PZ  [HDR-TH_24P-P2.54-V-F]
U46  PM2.54-1*5  [HDR-TH_5P-P2.54-V-F]
U47  2.0-2*3P母  [HDR-TH_6P-P2.00-V-F-R2-C3-S2.00]
U48  PM2.54-1*5  [HDR-TH_5P-P2.54-V-F]
U49  HX PZ2.54-3x4P ZZ  [HDR-TH_12P-P2.54-V-M-R3-C4-S2.54]
U50  HX PZ2.54-3x4P ZZ  [HDR-TH_12P-P2.54-V-M-R3-C4-S2.54]
USB1  904-131A2032S10100  [USB-A-SMD_FUS270-FSBW5K]

## Library data of the parts
CN56-CN63 CN72-CN87 = ZX-XH2.54-3PZZ: Pins Structure:1x3P Pitch:2.5mm Mounting Type:Direct Insert Reference Series:XH Number of Pins:3P Number of Rows:1 Number of PINs Per Row:3 Row Spacing:- Rated Current:3A Contact Material:Brass Contact Plating:Tin Operating Temperature:-25℃~+85℃ Operating; LCSC Part Name: 1x3P 间距:2.5mm 直插 系列:XH; Supplier Part: C7429633; Manufacturer: Megastar(兆星); Supplier Footprint: 插件,P=2.5mm; JLCPCB Part Class: Extended Part; Datasheet: https://atta.szlcsc.com/upload/public/pdf/source/20230619/AE17037A2CFDBE8D9CBA775D61AD0A84.pdf; Supplier: LCSC; Pins Structure: 1x3P; Pitch: 2.5mm; Mounting Type: Direct Insert; Reference Series: XH; Number of Pins: 3P; Number of Rows: 1; Number of PINs Per Row: 3; Rated Current: 3A; Contact Material: Brass; Contact Plating: Tin; Operating Temperature: -25℃~+85℃; Rated Voltage (Max): 250V; Plastic Material: PA66; Flame Retardant Rating: UL94V-0; Color: White; Z-Height of the Board: 7mm; X-Length of Bottom Edge on Board (Spacing Line): 10mm; Y-Width of Bottom Edge on Board: 5.9mm
U39 = CD74HC4051M96: Switch Circuit:SPST(SPST) Number of Channels:8 Supply Voltage:2V~6V Supply Voltage:2V~6V On-State Resistance (Max):240Ω Operating Temperature:-55℃~+125℃ Operating Temperature:-55℃~+125℃; LCSC Part Name: CD74HC4051 8通道模拟多路复用器; Supplier Part: C132065; Manufacturer: TI(德州仪器); Supplier Footprint: SOIC-16; JLCPCB Part Class: Extended Part; Datasheet: https://www.ti.com/cn/lit/gpn/cd74hc4051; Supplier: LCSC; Switch Circuit: SPST(SPST); Number of Channels: 8; Supply Voltage: 2V~6V; On-State Resistance (Max): 240Ω; Operating Temperature: -55℃~+125℃
GPIO1 GPIO2 = PZ254V-11-04P: Pin Structure:1x4P Pitch:2.54mm Row Spacing:- Circluar Pins/Square Pins:Square Pins Mounting Type:Straight Number of Rows:Plugin Number of Pins:4P Current Rating (Max):3A Voltage Rating (Max):250V Length of Mating Pin:6mm Insulation Height:2.5mm Length of; LCSC Part Name: 间距:2.54mm 1x4P 直插 方针; Supplier Part: C2691448; Manufacturer: XFCN(兴飞); Supplier Footprint: 插件,P=2.54mm; JLCPCB Part Class: Extended Part; Datasheet: https://atta.szlcsc.com/upload/public/pdf/source/20200309/C492403_F9F19131791D08044AD4F84F8E751A34.pdf; Supplier: LCSC; Pin Structure: 1x4P; Pitch: 2.54mm; Circluar Pins/Square Pins: Square Pins; Mounting Type: Straight; Number of Rows: Plugin; Number of Pins: 4P; Current Rating (Max): 3A; Voltage Rating (Max): 250V; Length of Mating Pin: 6mm; Insulation Height: 2.5mm; Length of End Connection Pin: 3mm; Operating Temperature Range: -40℃~+105℃; Color: Black
I2C1-A0-I2C1-A2 I2C1-PWR1 I2CX-A0-I2CX-A2 PWM-A0-PWM-A5 = PZ254V-11-03P: Pin Structure:1x3P Pitch:2.54mm Row Spacing:- Circluar Pins/Square Pins:Policy Mounting Type:Straight Number of Rows:Single Row Number of Pins:3P Current Rating:3A Voltage Rating (Max):250V Length of Mating Pin:6mm Insulation Height:2.5mm Length of End Co; LCSC Part Name: 1x3P 间距:2.54mm 方针 直插; Supplier Part: C2937625; Manufacturer: XFCN(兴飞); Supplier Footprint: 插件,P=2.54mm; JLCPCB Part Class: Extended Part; Datasheet: https://atta.szlcsc.com/upload/public/pdf/source/20200309/C492402_8335C3D49C4E4C618838D59BB1D024C1.pdf; Supplier: LCSC; Pin Structure: 1x3P; Pitch: 2.54mm; Circluar Pins/Square Pins: Policy; Mounting Type: Straight; Number of Rows: Single Row; Number of Pins: 3P; Current Rating: 3A; Voltage Rating (Max): 250V; Length of Mating Pin: 6mm; Insulation Height: 2.5mm; Length of End Connection Pin: 3mm; Operating Temperature: -40℃~+105℃; Color: Black
R1-R18 R51 = 0603WAF3001T5E: Type:Thick Film Resistors Resistance:3kΩ Tolerance:±1% Tolerance:±1% Power(Watts):0.1W Voltage-Supply(Max):75V Temperature Coefficient:±100ppm/℃ Temperature Coefficient:±100ppm/℃ Operating Temperature:-55℃~+155℃ Operating Temperature:-55℃~+155℃; LCSC Part Name: 3kΩ ±1% 100mW 厚膜电阻; Supplier Part: C4211; Manufacturer: UNI-ROYAL(厚声); Supplier Footprint: 0603; JLCPCB Part Class: Basic Part; Datasheet: https://atta.szlcsc.com/upload/public/pdf/source/20200306/C422600_1E6D84923E4A46A82E41ADD87F860B5C.pdf; Supplier: LCSC; Type: Thick Film Resistors; Tolerance: ±1%; Power(Watts): 0.1W; Voltage-Supply(Max): 75V; Temperature Coefficient: ±100ppm/℃; Operating Temperature: -55℃~+155℃
RN1-RN4 = 4D03WGJ0103T5E: Number of Resistors: Resistance:10kΩ Tolerance:±5% Tolerance:±5% Power(Watts): Temperature Coefficient:±200ppm/℃ Temperature Coefficient:±200ppm/℃ Number of Pins:; LCSC Part Name: 10kΩ ±5%; Supplier Part: C29718; Manufacturer: UNI-ROYAL(厚声); Supplier Footprint: 0603x4; JLCPCB Part Class: Basic Part; Datasheet: https://atta.szlcsc.com/upload/public/pdf/source/20191224/C474318_2527498AE30E813171187CCD28401A71.pdf; Supplier: LCSC; Tolerance: ±5%; Temperature Coefficient: ±200ppm/℃
U17 = TCA9535PWR: Interface:I2C；SMBus Number of I/O:16 Interrupt Output:With Interrupt Output Output Type:- Voltage - Supply:1.65V~5.5V Voltage - Supply:1.65V~5.5V Current - Output Low(IOL):- Current - Output High(IOH):- Clock Frequency:400kHz Operating Temperature:-40℃~+8; Supplier Part: C130204; Manufacturer: TI(德州仪器); Supplier Footprint: TSSOP-24; JLCPCB Part Class: Extended Part; Datasheet: https://www.ti.com/cn/lit/gpn/tca9535; Supplier: LCSC; Interface: I2C；SMBus; Number of I/O: 16; Interrupt Output: With Interrupt Output; Voltage - Supply: 1.65V~5.5V; Clock Frequency: 400kHz; Operating Temperature: -40℃~+85℃
CN10-CN12 I2C0-I2C7 SONAR0-SONAR3 = ZX-XH2.54-4PZZ: Pins Structure:1x4P Pitch:2.5mm Mounting Type:Direct Insert Reference Series:XH Number of Pins:4P Number of Rows:1 Number of PINs Per Row:4 Row Spacing:- Rated Current:3A Contact Material:Brass Contact Plating:Tin Operating Temperature:-25℃~+85℃ Operating; LCSC Part Name: 1x4P 间距:2.5mm 直插 系列:XH; Supplier Part: C7429634; Manufacturer: Megastar(兆星); Supplier Footprint: 插件,P=2.5mm; JLCPCB Part Class: Extended Part; Datasheet: https://atta.szlcsc.com/upload/public/pdf/source/20230619/B529A2163E0159A644AB3383D208FB03.pdf; Supplier: LCSC; Pins Structure: 1x4P; Pitch: 2.5mm; Mounting Type: Direct Insert; Reference Series: XH; Number of Pins: 4P; Number of Rows: 1; Number of PINs Per Row: 4; Rated Current: 3A; Contact Material: Brass; Contact Plating: Tin; Operating Temperature: -25℃~+85℃; Rated Voltage (Max): 250V; Plastic Material: PA66; Flame Retardant Rating: UL94V-0; Color: White; Z-Height of the Board: 7mm; X-Length of Bottom Edge on Board (Spacing Line): 12.5mm; Y-Width of Bottom Edge on Board: 5.9mm
U2 = TCA9548APWR: Supplier Part: C130026; Manufacturer: TI(德州仪器); Supplier Footprint: TSSOP-24; JLCPCB Part Class: Extended Part; Datasheet: https://www.ti.com/cn/lit/gpn/tca9548a; Supplier: LCSC
U4 U8 U40 U41 = ZX-XH2.54-6PZZ: Pins Structure:1x6P Pitch:2.5mm Mounting Type:Direct Insert Reference Series:XH Number of Pins:6P Number of Rows:1 Number of PINs Per Row:6 Row Spacing:- Rated Current:3A Contact Material:Brass Contact Plating:Tin Operating Temperature:-25℃~+85℃ Operating; LCSC Part Name: 1x6P 间距:2.5mm 直插 系列:XH; Supplier Part: C7429636; Manufacturer: Megastar(兆星); Supplier Footprint: 插件,P=2.5mm; JLCPCB Part Class: Extended Part; Datasheet: https://atta.szlcsc.com/upload/public/pdf/source/20230619/1243AD0A516E39CD3D274D8985780568.pdf; Supplier: LCSC; Pins Structure: 1x6P; Pitch: 2.5mm; Mounting Type: Direct Insert; Reference Series: XH; Number of Pins: 6P; Number of Rows: 1; Number of PINs Per Row: 6; Rated Current: 3A; Contact Material: Brass; Contact Plating: Tin; Operating Temperature: -25℃~+85℃; Rated Voltage (Max): 250V; Plastic Material: PA66; Flame Retardant Rating: UL94V-0; Color: White; Z-Height of the Board: 7mm; X-Length of Bottom Edge on Board (Spacing Line): 17.5mm; Y-Width of Bottom Edge on Board: 5.9mm
U5 U6 U42 = ZX-XH2.54-5PZZ: Pins Structure:1x5P Pitch:2.5mm Mounting Type:Direct Insert Reference Series:XH Number of Pins:5P Number of Rows:1 Number of PINs Per Row:5 Row Spacing:- Rated Current:3A Contact Material:Brass Contact Plating:Tin Operating Temperature:-25℃~+85℃ Operating; LCSC Part Name: 1x5P 间距:2.5mm 直插 系列:XH; Supplier Part: C7429635; Manufacturer: Megastar(兆星); Supplier Footprint: 插件,P=2.5mm; JLCPCB Part Class: Extended Part; Datasheet: https://atta.szlcsc.com/upload/public/pdf/source/20230619/60EEF4ADD558E90BFFACF5D939816781.pdf; Supplier: LCSC; Pins Structure: 1x5P; Pitch: 2.5mm; Mounting Type: Direct Insert; Reference Series: XH; Number of Pins: 5P; Number of Rows: 1; Number of PINs Per Row: 5; Rated Current: 3A; Contact Material: Brass; Contact Plating: Tin; Operating Temperature: -25℃~+85℃; Rated Voltage (Max): 250V; Plastic Material: PA66; Flame Retardant Rating: UL94V-0; Color: White; Z-Height of the Board: 7mm; X-Length of Bottom Edge on Board (Spacing Line): 15mm; Y-Width of Bottom Edge on Board: 5.9mm
C1-C3 = VT10UF16V167RV0128: Capacitance: Tolerance:±20% Tolerance:±20% Rated Voltage: Ripple Current:18mA@120kHz Equivalent Series Resistance(ESR):- φD: L: Lifetime @ Temp:2000hrs@105℃ Operating Temperature:-55℃~+105℃ Operating Temperature:-55℃~+105℃; LCSC Part Name: 10uF ±20% 16V; Supplier Part: C5246581; Manufacturer: KNSCHA(科尼盛); Supplier Footprint: SMD,D4xL5.4mm; JLCPCB Part Class: Extended Part; Datasheet: https://atta.szlcsc.com/upload/public/pdf/source/20221103/9F9BF07BB249386F3919A1DEC4ACBDCD.pdf; Supplier: LCSC; Tolerance: ±20%; Ripple Current: 18mA@120kHz; Lifetime @ Temp: 2000hrs@105℃; Operating Temperature: -55℃~+105℃
F1-F4 = YC164-JR-07220RL: Number of Resistors: Resistance: Tolerance:±5% Tolerance:±5% Power(Watts): Temperature Coefficient:±200ppm/℃ Temperature Coefficient:±200ppm/℃ Number of Pins:; LCSC Part Name: 220Ω ±5% 0603x4; Supplier Part: C706474; Manufacturer: YAGEO(国巨); Supplier Footprint: 0603x4; JLCPCB Part Class: Extended Part; Datasheet: https://atta.szlcsc.com/upload/public/pdf/source/20181031/C326869_C8B113A8CFF0517934C636AB0D29A6BD.pdf; Supplier: LCSC; Tolerance: ±5%; Temperature Coefficient: ±200ppm/℃
H2-H17 H19 = PH-00013: Pin Structure:1x2P Pitch:2.54mm Row Spacing:- Circluar Pins/Square Pins:Policy Mounting Type:Straight Number of Rows:Single Row Number of Pins:2P Current Rating:3A Voltage Rating (Max):- Length of Mating Pin:6mm Insulation Height:2.5mm Length of End Conne; LCSC Part Name: 1x2P 间距:2.54mm 方针 直插; Supplier Part: C2829889; Manufacturer: Liansheng(连盛); Supplier Footprint: 插件,P=2.54mm; JLCPCB Part Class: Extended Part; Datasheet: https://atta.szlcsc.com/upload/public/pdf/source/20210507/C2829889_3A6FAD2FEED7D368F2C068C6BF5A862B.pdf; Supplier: LCSC; Pin Structure: 1x2P; Pitch: 2.54mm; Circluar Pins/Square Pins: Policy; Mounting Type: Straight; Number of Rows: Single Row; Number of Pins: 2P; Current Rating: 3A; Length of Mating Pin: 6mm; Insulation Height: 2.5mm; Length of End Connection Pin: 3mm; Operating Temperature: -40℃~+105℃; Color: Black
LED1-LED16 = 19-219/GHC-YR2T1B5Y/3T: Lamp Holder Type:- Emitted Color:Green Forward Voltage (VF):- Forward Voltage (VF):- Power Dissipation:- Forward Current:- Dominant Wavelength:518nm Dominant Wavelength:518nm Peak Wavelength:525nm Diode Configuration:- Lens Color:Colorless transparent len; LCSC Part Name: 0603正贴式 绿灯(Iv=140~360mcd) @IF=20mA); Supplier Part: C2994781; Manufacturer: EVERLIGHT(亿光); Supplier Footprint: 0603; JLCPCB Part Class: Extended Part; Datasheet: https://atta.szlcsc.com/upload/public/pdf/source/20220419/8956FAA3247BD76AC23F3FF602030F9E.pdf; Supplier: LCSC; Emitted Color: Green; Dominant Wavelength: 518nm; Peak Wavelength: 525nm; Lens Color: Colorless transparent lens
U18 = PCA9685PW,118: Type:- Input Voltage:2.3V~5.5V Input Voltage:2.3V~5.5V Switch Frequency:100kHz~1MHz Switch Frequency:100kHz~1MHz Channels:16 Output Voltage:5.5V Output Voltage:5.5V Output Current:25mA Dimming:PWM Operating temperature:-40℃~+85℃ Operating temperature:-40℃; Supplier Part: C2678753; Manufacturer: NXP(恩智浦); Supplier Footprint: TSSOP-28; JLCPCB Part Class: Extended Part; Datasheet: https://atta.szlcsc.com/upload/public/pdf/source/20170908/C92206_1504870161626958140.pdf; Supplier: LCSC; Input Voltage: 2.3V~5.5V; Switch Frequency: 100kHz~1MHz; Channels: 16; Output Voltage: 5.5V; Output Current: 25mA; Dimming: PWM; Operating temperature: -40℃~+85℃
U19-U34 = BX-PZ2.54-2-3PZZ: Pin Structure:2x3P Pitch:2.54mm Row Spacing:2.54mm Circluar Pins/Square Pins:Policy Mounting Type:Straight Number of Rows:Double Row Number of Pins:3P Current Rating:3A Voltage Rating (Max):1kV Length of Mating Pin:6mm Insulation Height:2.5mm Length of En; LCSC Part Name: 2x3P 间距:2.54mm 方针 直插; Supplier Part: C18078212; Manufacturer: Bossie(博锡); Supplier Footprint: 插件,P=2.54mm; JLCPCB Part Class: Extended Part; Datasheet: https://atta.szlcsc.com/upload/public/pdf/source/20231017/19B93BCADDDD73CB54F402EECF4A0840.pdf; Supplier: LCSC; Pin Structure: 2x3P; Pitch: 2.54mm; Row Spacing: 2.54mm; Circluar Pins/Square Pins: Policy; Mounting Type: Straight; Number of Rows: Double Row; Number of Pins: 3P; Current Rating: 3A; Voltage Rating (Max): 1kV; Length of Mating Pin: 6mm; Insulation Height: 2.5mm; Length of End Connection Pin: 3mm; Contact Material: Brass; Contact Plating: Gold; Operating Temperature: -40℃~+105℃; Color: Black
U35 U36 = TXB0106PWR: Channel Type:Bidirectional Input Signal:- Output Signal:- Data Rate:100Mbps Voltage - Supply(VCCA):1.2V~3.6V Voltage - Supply(VCCA):1.2V~3.6V Voltage - Supply(VCCB):1.65V~5.5V Voltage - Supply(VCCB):1.65V~5.5V Number of Circuits:1 Number of Circuits:6 Out; LCSC Part Name: 100Mbps 6位双向电平转换器; Supplier Part: C38253; Manufacturer: TI(德州仪器); Supplier Footprint: TSSOP-16; JLCPCB Part Class: Extended Part; Datasheet: https://www.ti.com/cn/lit/gpn/txb0106; Supplier: LCSC; Channel Type: Bidirectional; Data Rate: 100Mbps; Voltage - Supply(VCCA): 1.2V~3.6V; Voltage - Supply(VCCB): 1.65V~5.5V; Number of Circuits: 6; Output Type: Tri-State; Operating Temperature: -40℃~+85℃; Features: Automatic Direction Detection
3.3VEXT1 5VEXT1 CUSTOM1 = WJ127-5.0-2P_C3703: Structure:1x2P Pitch:5mm Color:Green Mounting Style:Straight Current Rating (Max):15A Voltage Rating (Max):250V Number of Pins:2P Number of Rows:1 Wire Gauge - AWG:14~26 Wire Gauge - AWG:14~26 Wire Gauge - mm2:1.5 Wire Gauge - mm2:1.5 Number of PINs Per R; LCSC Part Name: 5mm 1x2P 排数:1 每排P数:2 直插; Supplier Part: C3703; Manufacturer: KANGNEX(康奈克斯电气); Supplier Footprint: 插件,P=5mm; JLCPCB Part Class: Extended Part; Datasheet: https://atta.szlcsc.com/upload/public/pdf/source/20191225/C3703_1F4D1F1BB9E32B564BC518663FFF2A0C.pdf; Supplier: LCSC; Structure: 1x2P; Pitch: 5mm; Color: Green; Mounting Style: Straight; Current Rating (Max): 15A; Voltage Rating (Max): 250V; Number of Pins: 2P; Number of Rows: 1; Wire Gauge - AWG: 14~26; Wire Gauge - mm2: 1.5; Number of PINs Per Row: 2; Operating Temperature Range: -40℃~+105℃
C4 = CT41G-0805-2X1-50V-0.1μF-K(N): Capacitance:100nF Tolerance:±10% Tolerance:±10% Voltage Rating:50V Temperature Coefficient:-; LCSC Part Name: 100nF ±10% 50V; Supplier Part: C126469; Manufacturer: TORCH(火炬); Supplier Footprint: 0805; JLCPCB Part Class: Extended Part; Datasheet: https://atta.szlcsc.com/upload/public/pdf/source/20171225/C150708_15141883600121203188.pdf; Supplier: LCSC; Tolerance: ±10%; Voltage Rating: 50V
CR2032 = CR2032-BS-6: LCSC Part Name: 电池底座 CR2032-BS-6镀金贴板式电池座连接器; Supplier Part: C22363833; Manufacturer: LX(连欣科技); Supplier Footprint: SMD; JLCPCB Part Class: Extended Part; Datasheet: https://atta.szlcsc.com/upload/public/pdf/source/20240319/678C0773FABC2C605DCA22348524B46A.pdf; Supplier: LCSC
ETHERNET1 = J1B1211CCD: Connector Type:RJ45Receptacle Number of Ports:1 Mounting Style:Right-Angle Shielding:有屏蔽 LED:WithLED Ratings:cat5 Contact Material:磷黄铜 Contact Plating:Gold Operating Temperature Range:-40℃~+85℃ Operating Temperature Range:-40℃~+85℃; LCSC Part Name: 弯插 带LED; Supplier Part: C910371; Manufacturer: WIZNET; Supplier Footprint: 插件; JLCPCB Part Class: Extended Part; Datasheet: https://atta.szlcsc.com/upload/public/pdf/source/20201117/C910371_B77FEBE130C68A4769342AE009D6CC4A.pdf; Supplier: LCSC; Connector Type: RJ45Receptacle; Number of Ports: 1; Mounting Style: Right-Angle; Shielding: 有屏蔽; LED: WithLED; Ratings: cat5; Contact Material: 磷黄铜; Contact Plating: Gold; Operating Temperature Range: -40℃~+85℃
H18 = HX PZ2.54-2x2P ZZ: Pin Structure:2x2P Pitch:2.54mm Row Spacing:2.54mm Circluar Pins/Square Pins:Policy Mounting Type:Straight Number of Rows:Double Row Number of Pins:4P Current Rating:3A Voltage Rating (Max):- Length of Mating Pin:6mm Insulation Height:2.5mm Length of End; LCSC Part Name: 2x2P 间距:2.54mm 方针 直插; Supplier Part: C32713275; Manufacturer: hanxia(韩下); Supplier Footprint: 插件,P=2.54mm; JLCPCB Part Class: Extended Part; Datasheet: https://atta.szlcsc.com/upload/public/pdf/source/20240723/CE5FF0E3D3DC0CA9D26CA3411A561CD4.pdf; Supplier: LCSC; Pin Structure: 2x2P; Pitch: 2.54mm; Row Spacing: 2.54mm; Circluar Pins/Square Pins: Policy; Mounting Type: Straight; Number of Rows: Double Row; Number of Pins: 4P; Current Rating: 3A; Length of Mating Pin: 6mm; Insulation Height: 2.5mm; Length of End Connection Pin: 3mm; Contact Material: Brass; Contact Plating: Gold; Operating Temperature: -40℃~+105℃; Color: Black
U1 = Teensy4.1
U43 U44 = HC-PM254-8.5H-1x24PZ: Holes Structure:1x24P Pitch:2.54mm Row Spacing:- Circular Hole / Square Hole:Square Hole Mounting Type:Direct Insert Number of Rows:Single Row Number of Positions:24P Current Rating:3A Voltage Rating (Max):- Holes Direction:Top Insulation Height:8.5mm Con; LCSC Part Name: 间距2.54mm 1x24Pin 直插 PC3.0 H8.5; Supplier Part: C41376163; Manufacturer: HC(虹成电子); Supplier Footprint: 插件,P=2.54mm; JLCPCB Part Class: Extended Part; Datasheet: https://atta.szlcsc.com/upload/public/pdf/source/20250106/3FBD04873CC9DF7EB7D4CB725B508409.pdf; Supplier: LCSC; Holes Structure: 1x24P; Pitch: 2.54mm; Circular Hole / Square Hole: Square Hole; Mounting Type: Direct Insert; Number of Rows: Single Row; Number of Positions: 24P; Current Rating: 3A; Holes Direction: Top; Insulation Height: 8.5mm; Contact Material: Brass; Contact Plating: Gold; Operating Temperature: -40℃~+105℃; PIN Length: 3mm
U46 U48 = PM2.54-1*5: Holes Structure:1x5P Pitch:2.54mm Row Spacing:2.54mm Circular Hole / Square Hole:方孔 Mounting Type:Straight Number of Rows:Plugin Number of Holes:5P Current Rating (Max):2.5A Holes Direction:Top Insulation Height:8.5mm Operating Temperature Range:-40℃~+105; LCSC Part Name: 间距:2.54mm 1x5P 直插; Supplier Part: C5116488; Manufacturer: ZHOURI(洲日); Supplier Footprint: 插件,P=2.54mm; JLCPCB Part Class: Extended Part; Datasheet: https://atta.szlcsc.com/upload/public/pdf/source/20220803/9CD49C6F5EDF44A82395C8C3734B0185.pdf; Supplier: LCSC; Holes Structure: 1x5P; Pitch: 2.54mm; Row Spacing: 2.54mm; Circular Hole / Square Hole: 方孔; Mounting Type: Straight; Number of Rows: Plugin; Number of Holes: 5P; Current Rating (Max): 2.5A; Holes Direction: Top; Insulation Height: 8.5mm; Operating Temperature Range: -40℃~+105℃
U47 = 2.0-2*3P母: Holes Structure:2x3P Pitch:2mm Row Spacing:2mm Mounting Type:Straight Number of Rows:双排 Number of Holes:6P Insulation Height:- Contact Material:Brass Contact Plating:Gold; LCSC Part Name: 间距:2mm 2x3P 直插; Supplier Part: C110428; Manufacturer: BOOMELE(博穆精密); Supplier Footprint: 插件,P=2mm; JLCPCB Part Class: Extended Part; Datasheet: https://atta.szlcsc.com/upload/public/pdf/source/20181108/C110428_AF8FEAA691FE93BA7EAA0C005FA72101.pdf; Supplier: LCSC; Holes Structure: 2x3P; Pitch: 2mm; Row Spacing: 2mm; Mounting Type: Straight; Number of Rows: 双排; Number of Holes: 6P; Contact Material: Brass; Contact Plating: Gold
U49 U50 = HX PZ2.54-3x4P ZZ: LCSC Part Name: 3x4P 间距:2.54mm 方针 直插; Supplier Part: C32713291; Manufacturer: hanxia(韩下); Supplier Footprint: 插件,P=2.54mm; JLCPCB Part Class: Extended Part; Datasheet: https://atta.szlcsc.com/upload/public/pdf/source/20240723/03D5BD78F4265407C742BB8D20821E6B.pdf; Supplier: LCSC; Pin Structure: 3x4P; Pitch: 2.54mm; Row Spacing: 2.54mm; Circluar Pins/Square Pins: Policy; Mounting Type: Straight; Number of Rows: Triple row; Number of Pins: 12P; Current Rating: 3A; Length of Mating Pin: 6mm; Insulation Height: 2.5mm; Length of End Connection Pin: 3mm; Contact Material: Brass; Contact Plating: Gold; Operating Temperature: -40℃~+105℃; Color: Black
USB1 = 904-131A2032S10100: LCSC Part Name: Type-A 母; Supplier Part: C8328; Manufacturer: 精拓金; Supplier Footprint: SMD; JLCPCB Part Class: Extended Part; Datasheet: https://atta.szlcsc.com/upload/public/pdf/source/20230426/86156DC426950386CADE071C42A84753.pdf; Supplier: LCSC; Connector Type: Type-A; Standard: USB 2.0; Gender: Female; Number of Ports: 1; Number of Contacts: 4P; Current Rating - Power (Max): 1.5A

## Nets
3.3V: PWM-A0.1 PWM-A1.1 PWM-A2.1 PWM-A3.1 PWM-A4.1 PWM-A5.1 U18.28(VDD)
3.3VEXT: 3.3VEXT1.2 C1.1 H19.1 I2C1-PWR1.3 U19.1 U20.1 U21.1 U22.1 U23.1 U24.1 U25.1 U26.1 U27.1 U28.1 U29.1 U30.1 U31.1 U32.1 U33.1 U34.1
3V3: CN10.1 CN11.1 CN12.1 CN56.2 CN57.2 CN58.2 CN59.2 CN60.2 CN61.2 CN62.2 CN63.2 H19.2 I2C1-A0.1 I2C1-A1.1 I2C1-A2.1 I2C1-PWR1.1 I2CX-A0.1 I2CX-A1.1 I2CX-A2.1 R1.1 R2.1 R3.1 R4.1 R5.1 R6.1 R7.1 R8.1 R9.2 R10.2 R11.2 R12.2 R13.2 R14.2 R15.2 R16.2 R17.2 R18.2 R51.2 RN1.1 RN1.2 RN1.3 RN1.4 RN2.1 RN2.2 RN2.3 RN2.4 RN3.1 RN3.2 RN3.3 RN3.4 RN4.1 RN4.2 RN4.3 RN4.4 U1.15(3V3) U1.46(3V3) U1.51(3V3) U2.24(VCC) U5.1 U6.1 U17.24(VCC) U35.2(VCCA) U36.2(VCCA) U39.16(VCC) U42.1 U43.3 U44.15 U48.4 U49.3 U49.6 U49.9 U49.12 U50.3 U50.6 U50.9 U50.12
GND: 3.3VEXT1.1 5VEXT1.1 C1.2 C2.2 C3.2 C4.2 CN10.2 CN11.2 CN12.2 CN56.1 CN57.1 CN58.1 CN59.1 CN60.1 CN61.1 CN62.1 CN63.1 CN72.1 CN73.1 CN74.1 CN75.1 CN76.1 CN77.1 CN78.1 CN79.1 CN80.1 CN81.1 CN82.1 CN83.1 CN84.1 CN85.1 CN86.1 CN87.1 CR2032.2 CUSTOM1.1 ETHERNET1.8 ETHERNET1.9(LLED-) H18.1 H18.3 I2C0.1 I2C1.1 I2C1-A0.3 I2C1-A1.3 I2C1-A2.3 I2C2.1 I2C3.1 I2C4.1 I2C5.1 I2C6.1 I2C7.1 I2CX-A0.3 I2CX-A1.3 I2CX-A2.3 LED1.2(K) LED2.2(K) LED3.2(K) LED4.2(K) LED5.2(K) LED6.2(K) LED7.2(K) LED8.2(K) LED9.2(K) LED10.2(K) LED11.2(K) LED12.2(K) LED13.2(K) LED14.2(K) LED15.2(K) LED16.2(K) PWM-A0.3 PWM-A1.3 PWM-A2.3 PWM-A3.3 PWM-A4.3 PWM-A5.3 SONAR0.2 SONAR1.2 SONAR2.2 SONAR3.2 U1.1(GND) U1.34(GND) U1.47(GND) U1.52(GND) U1.58(GND) U1.59(GND) U1.64(GND) U2.12(GND) U4.2 U5.2 U6.2 U8.2 U17.12(GND) U18.14(VSS) U18.25(EXTCLK) U35.9(GND) U36.9(GND) U39.7(VEE) U39.8(GND) U40.2 U41.2 U42.2 U43.2 U43.15 U44.1 U46.4 U46.5 U47.4 U48.3 U49.1 U49.4 U49.7 U49.10 U50.1 U50.4 U50.7 U50.10 USB1.4(GND) USB1.5
VBAT: CR2032.1 U1.50(VBAT) U48.5
VIN: 5VEXT1.2 C2.1 SONAR0.1 SONAR1.1 SONAR2.1 SONAR3.1 U1.48(VIN) U4.1 U8.1 U19.3 U20.3 U21.3 U22.3 U23.3 U24.3 U25.3 U26.3 U27.3 U28.3 U29.3 U30.3 U31.3 U32.3 U33.3 U34.3 U35.8(OE) U35.15(VCCB) U36.8(OE) U36.15(VCCB) U40.1 U41.1 U43.1
A0: U1.36(14_A0_TX3_SPDIF_OUT) U39.10(S1) U43.13
A1: U1.37(15_A1_RX3_SPDIF_IN) U39.11(S0) U43.12
A17: U1.33(41_A17) U39.9(S2) U43.16
ANALOG: U1.32(40_A16) U39.3(A) U43.17
ANALOG-EN: RN2.5 U17.11(P07) U39.6(/E)
BCLK2: U1.6(4_BCLK2) U44.6 U49.2
CRX1: CN10.3 U1.45(23_A9_CRX1_MCLK1) U43.4
CS: U1.12(10_CS_MQSR) U44.12 U50.2
CTX1: CN10.4 U1.44(22_A8_CTX1) U43.5
CUST: C3.1 CUSTOM1.2 U19.5 U20.5 U21.5 U22.5 U23.5 U24.5 U25.5 U26.5 U27.5 U28.5 U29.5 U30.5 U31.5 U32.5 U33.5 U34.5
ECHO0: U1.22(30_CRX3) U35.7(A6) U44.22
ECHO1: U1.24(32_OUT1B) U35.5(A4) U44.24
ECHO2: U1.26(34_RX8) U36.7(A6) U43.23
ECHO3: U1.28(36_CS) U36.5(A4) U43.21
I2C1-RESET: RN1.8 U2.3(RESET#) U17.4(P00)
I2C2-RESET: RN1.7 U17.5(P01)
IN1: U1.30(38_CS1_IN1) U43.19 U50.5
IN2: R51.1 U1.7(5_IN2) U17.1(INT#) U44.7
LRCLK2: U1.5(3_LRCLK2) U42.5 U44.5
MISO: U1.14(12_MISO_MQSL) U4.4 U8.4 U44.14
MISO1: U1.31(39_MISO1_OUT1A) U40.4 U41.4 U43.18
MOSI: U1.13(11_MOSI_CTX1) U4.3 U8.3 U44.13
MOSI1: U1.18(26_A12_MOSI1) U40.3 U41.3 U44.18
ON_OFF: H18.4 U1.54(ON_OFF) U48.1
OUT1C: U1.11(9_OUT1C) U5.5 U44.11
OUT1D: U1.8(6_OUT1D) U44.8 U49.5
OUT2: U1.4(2_OUT2) U6.5 U44.4
PROGRAM: H18.2 U1.53(PROGRAM) U48.2
PWM-OE: RN1.6 U17.6(P02) U18.23(OE#)
RX1: U1.2(0_RX1_CRX2_CS1) U6.3 U44.2
RX2: U1.9(7_RX2_OUT1A) U44.9 U49.8
RX5: U1.43(21_A7_RX5_BCLK1) U42.3 U43.6
RX7: U1.20(28_RX7) U5.3 U44.20
SCK: U1.35(13_SCK_LED) U4.5 U8.5 U43.14
SCK1: U1.19(27_A13_SCK1) U40.5 U41.5 U44.19
SCL: R17.1 U1.41(19_A5_SCL) U2.22(SCL) U17.22(SCL) U18.26(SCL) U43.8
SCL1: U1.38(16_A2_RX4_SCL1) U43.11 U50.8
SCL2: CN11.3 CN12.3 U1.16(24_A10_TX6_SCL2) U44.16
SDA: R18.1 U1.40(18_A4_SDA) U2.23(SDA) U17.23(SDA) U18.27(SDA) U43.9
SDA1: U1.39(17_A3_TX4_SDA1) U43.10 U50.11
SDA2: CN11.4 CN12.4 U1.17(25_A11_RX6_SDA2) U44.17
SPI0-SEL: RN1.5 U8.6 U17.7(P03)
SPI1-SEL: RN2.8 U4.6 U17.8(P04)
SPI2-SEL: RN2.7 U17.9(P05) U41.6
SPI3-SEL: RN2.6 U17.10(P06) U40.6
TRIG0: U1.23(31_CTX3) U35.6(A5) U44.23
TRIG1: U1.25(33_MCLK2) U35.4(A3) U43.24
TRIG2: U1.27(35_TX8) U36.6(A5) U43.22
TRIG3: U1.29(37_CS) U36.4(A3) U43.20
TX1: U1.3(1_TX1_CTX2_MISO1) U6.4 U44.3
TX2: U1.10(8_TX2_IN1) U44.10 U49.11
TX5: U1.42(20_A6_TX5_LRCLK1) U42.4 U43.7
TX7: U1.21(29_TX7) U5.4 U44.21
$1N1577: ETHERNET1.1 U1.63(T+) U47.6
$1N1619: ETHERNET1.3 U1.62(T-) U47.5
$1N1646: ETHERNET1.4 U1.60(R+) U47.1
$1N1726: ETHERNET1.6 U1.65(R-) U47.2
$1N1843: U1.57(D+) U46.3 USB1.3(D+)
$1N1943: U1.55(5V) U46.1 USB1.1(VCC)
$1N3751: U1.56(D-) U46.2 USB1.2(D-)
$1N6218: ETHERNET1.10(LLED+) U1.61(LED) U47.3
$1N6241: C4.1 ETHERNET1.2 ETHERNET1.5
$2N8074: PWM-A5.2 U18.24(A5)
$2N8075: PWM-A4.2 U18.5(A4)
$2N8076: PWM-A3.2 U18.4(A3)
$2N8077: PWM-A2.2 U18.3(A2)
$2N8078: PWM-A1.2 U18.2(A1)
$2N8079: PWM-A0.2 U18.1(A0)
$2N8081: F2.7 U18.11(LED5)
$2N8082: F2.8 U18.10(LED4)
$2N8083: F3.8 U18.15(LED8)
$2N8084: F3.7 U18.16(LED9)
$2N8085: F3.6 U18.17(LED10)
$2N8086: F3.5 U18.18(LED11)
$2N8087: F4.8 U18.19(LED12)
$2N8088: F4.7 U18.20(LED13)
$2N8089: F4.6 U18.21(LED14)
$2N8090: F4.5 U18.22(LED15)
$2N8091: CN72.3 F1.1 H3.1
$2N8092: CN75.3 F1.4 H5.1
$2N8093: CN76.3 F2.1 H6.1
$2N8094: CN77.3 F2.2 H7.1
$2N8095: CN79.3 F2.4 H9.1
$2N8096: CN80.3 F3.1 H10.1
$2N8097: CN81.3 F3.2 H11.1
$2N8098: CN82.3 F3.3 H12.1
$2N8099: CN83.3 F3.4 H13.1
$2N8100: CN84.3 F4.1 H14.1
$2N8101: CN85.3 F4.2 H15.1
$2N8102: CN87.3 F4.4 H17.1
$2N8103: CN72.2 U19.2 U19.4 U19.6
$2N8104: CN73.2 U20.2 U20.4 U20.6
$2N8105: CN74.2 U21.2 U21.4 U21.6
$2N8106: CN75.2 U22.2 U22.4 U22.6
$2N8107: CN76.2 U23.2 U23.4 U23.6
$2N8108: CN77.2 U24.2 U24.4 U24.6
$2N8109: CN78.2 U25.2 U25.4 U25.6
$2N8110: CN79.2 U26.2 U26.4 U26.6
$2N8111: CN80.2 U27.2 U27.4 U27.6
$2N8112: CN81.2 U28.2 U28.4 U28.6
$2N8113: CN82.2 U29.2 U29.4 U29.6
$2N8114: CN83.2 U30.2 U30.4 U30.6
$2N8115: CN84.2 U31.2 U31.4 U31.6
$2N8116: CN85.2 U32.2 U32.4 U32.6
$2N8117: CN86.2 U33.2 U33.4 U33.6
$2N8118: CN87.2 U34.2 U34.4 U34.6
$2N8122: H2.2 LED1.1(A)
$2N8123: H3.2 LED2.1(A)
$2N8124: H4.2 LED3.1(A)
$2N8125: H5.2 LED4.1(A)
$2N8126: H6.2 LED5.1(A)
$2N8127: H7.2 LED6.1(A)
$2N8128: H8.2 LED7.1(A)
$2N8129: H10.2 LED9.1(A)
$2N8130: H11.2 LED10.1(A)
$2N8131: H12.2 LED11.1(A)
$2N8132: H13.2 LED12.1(A)
$2N8133: H14.2 LED13.1(A)
$2N8134: H15.2 LED14.1(A)
$2N8135: H16.2 LED15.1(A)
$2N8136: H17.2 LED16.1(A)
$2N8137: H9.2 LED8.1(A)
$2N8141: CN74.3 F1.3 H4.1
$2N8142: CN73.3 F1.2 H2.1
$2N8143: F2.5 U18.13(LED7)
$2N8144: F2.6 U18.12(LED6)
$2N8145: CN78.3 F2.3 H8.1
$2N8146: CN86.3 F4.3 H16.1
$2N8147: F1.6 U18.8(LED2)
$2N8148: F1.5 U18.9(LED3)
$2N8150: F1.8 U18.6(LED0)
$2N8151: F1.7 U18.7(LED1)
$3N1505: I2C3.3 R8.2 U2.11(SC3)
$3N1506: I2C3.4 R7.2 U2.10(SD3)
$3N1508: I2C0.4 R1.2 U2.4(SD0)
$3N1509: I2C0.3 R2.2 U2.5(SC0)
$3N1510: I2C1.4 R3.2 U2.6(SD1)
$3N1511: I2C1.3 R4.2 U2.7(SC1)
$3N1512: I2C7.4 R10.1 U2.19(SD7)
$3N1513: I2C7.3 R9.1 U2.20(SC7)
$3N1514: I2C6.4 R12.1 U2.17(SD6)
$3N1515: I2C6.3 R11.1 U2.18(SC6)
$3N1516: I2C5.3 R13.1 U2.16(SC5)
$3N1517: I2C5.4 R14.1 U2.15(SD5)
$3N1518: I2C4.4 R16.1 U2.13(SD4)
$3N1519: I2C4.3 R15.1 U2.14(SC4)
$3N1520: I2C1-A2.2 U2.21(A2)
$3N1521: I2C2.3 R6.2 U2.9(SC2)
$3N1522: I2C2.4 R5.2 U2.8(SD2)
$3N1526: I2C1-A0.2 U2.1(A0)
$3N1527: I2C1-A1.2 U2.2(A1)
$3N3437: I2C0.2 I2C1.2 I2C1-PWR1.2 I2C2.2 I2C3.2 I2C4.2 I2C5.2 I2C6.2 I2C7.2
$4N777: I2CX-A2.2 U17.3(A2)
$4N779: I2CX-A0.2 U17.21(A0)
$4N780: I2CX-A1.2 U17.2(A1)
$4N790: GPIO2.4 RN3.8 U17.13(P10)
$4N792: GPIO2.3 RN3.7 U17.14(P11)
$4N793: GPIO2.2 RN3.6 U17.15(P12)
$4N794: GPIO2.1 RN3.5 U17.16(P13)
$4N795: GPIO1.4 RN4.8 U17.17(P14)
$4N796: GPIO1.3 RN4.7 U17.18(P15)
$4N797: GPIO1.2 RN4.6 U17.19(P16)
$4N798: GPIO1.1 RN4.5 U17.20(P17)
$6N608: CN63.3 U39.13(A0)
$6N609: CN62.3 U39.14(A1)
$6N610: CN61.3 U39.15(A2)
$6N611: CN59.3 U39.1(A4)
$6N612: CN60.3 U39.12(A3)
$6N613: CN58.3 U39.5(A5)
$6N614: CN57.3 U39.2(A6)
$6N620: CN56.3 U39.4(A7)
$7N550: SONAR2.3 U36.11(B5)
$7N551: SONAR2.4 U36.10(B6)
$7N553: SONAR3.3 U36.13(B3)
$7N554: SONAR3.4 U36.12(B4)
$7N556: SONAR0.3 U35.11(B5)
$7N557: SONAR0.4 U35.10(B6)
$7N558: SONAR1.3 U35.13(B3)
$7N559: SONAR1.4 U35.12(B4)

Not connected (* = marked no-connect by the designer): ETHERNET1 7* 11(RLED-)* 12(RLED+)* 13(GND)* 14(GND)*; U1 49(VUSB)* 66(D-)* 67(D+)*; U35 1(A1)* 3(A2)* 14(B2)* 16(B1)*; U36 1(A1)* 3(A2)* 14(B2)* 16(B1)*

## Notes on the sheets
sheet 5
- SPI-2 Bus
- SPI-1 Bus
- CANBUS
- I2C-3
- UART-1
- UART-3
- UART-2
sheet 6
- Analog Inputs
